# EAGLE design draft6 (EAGLE 6.3)
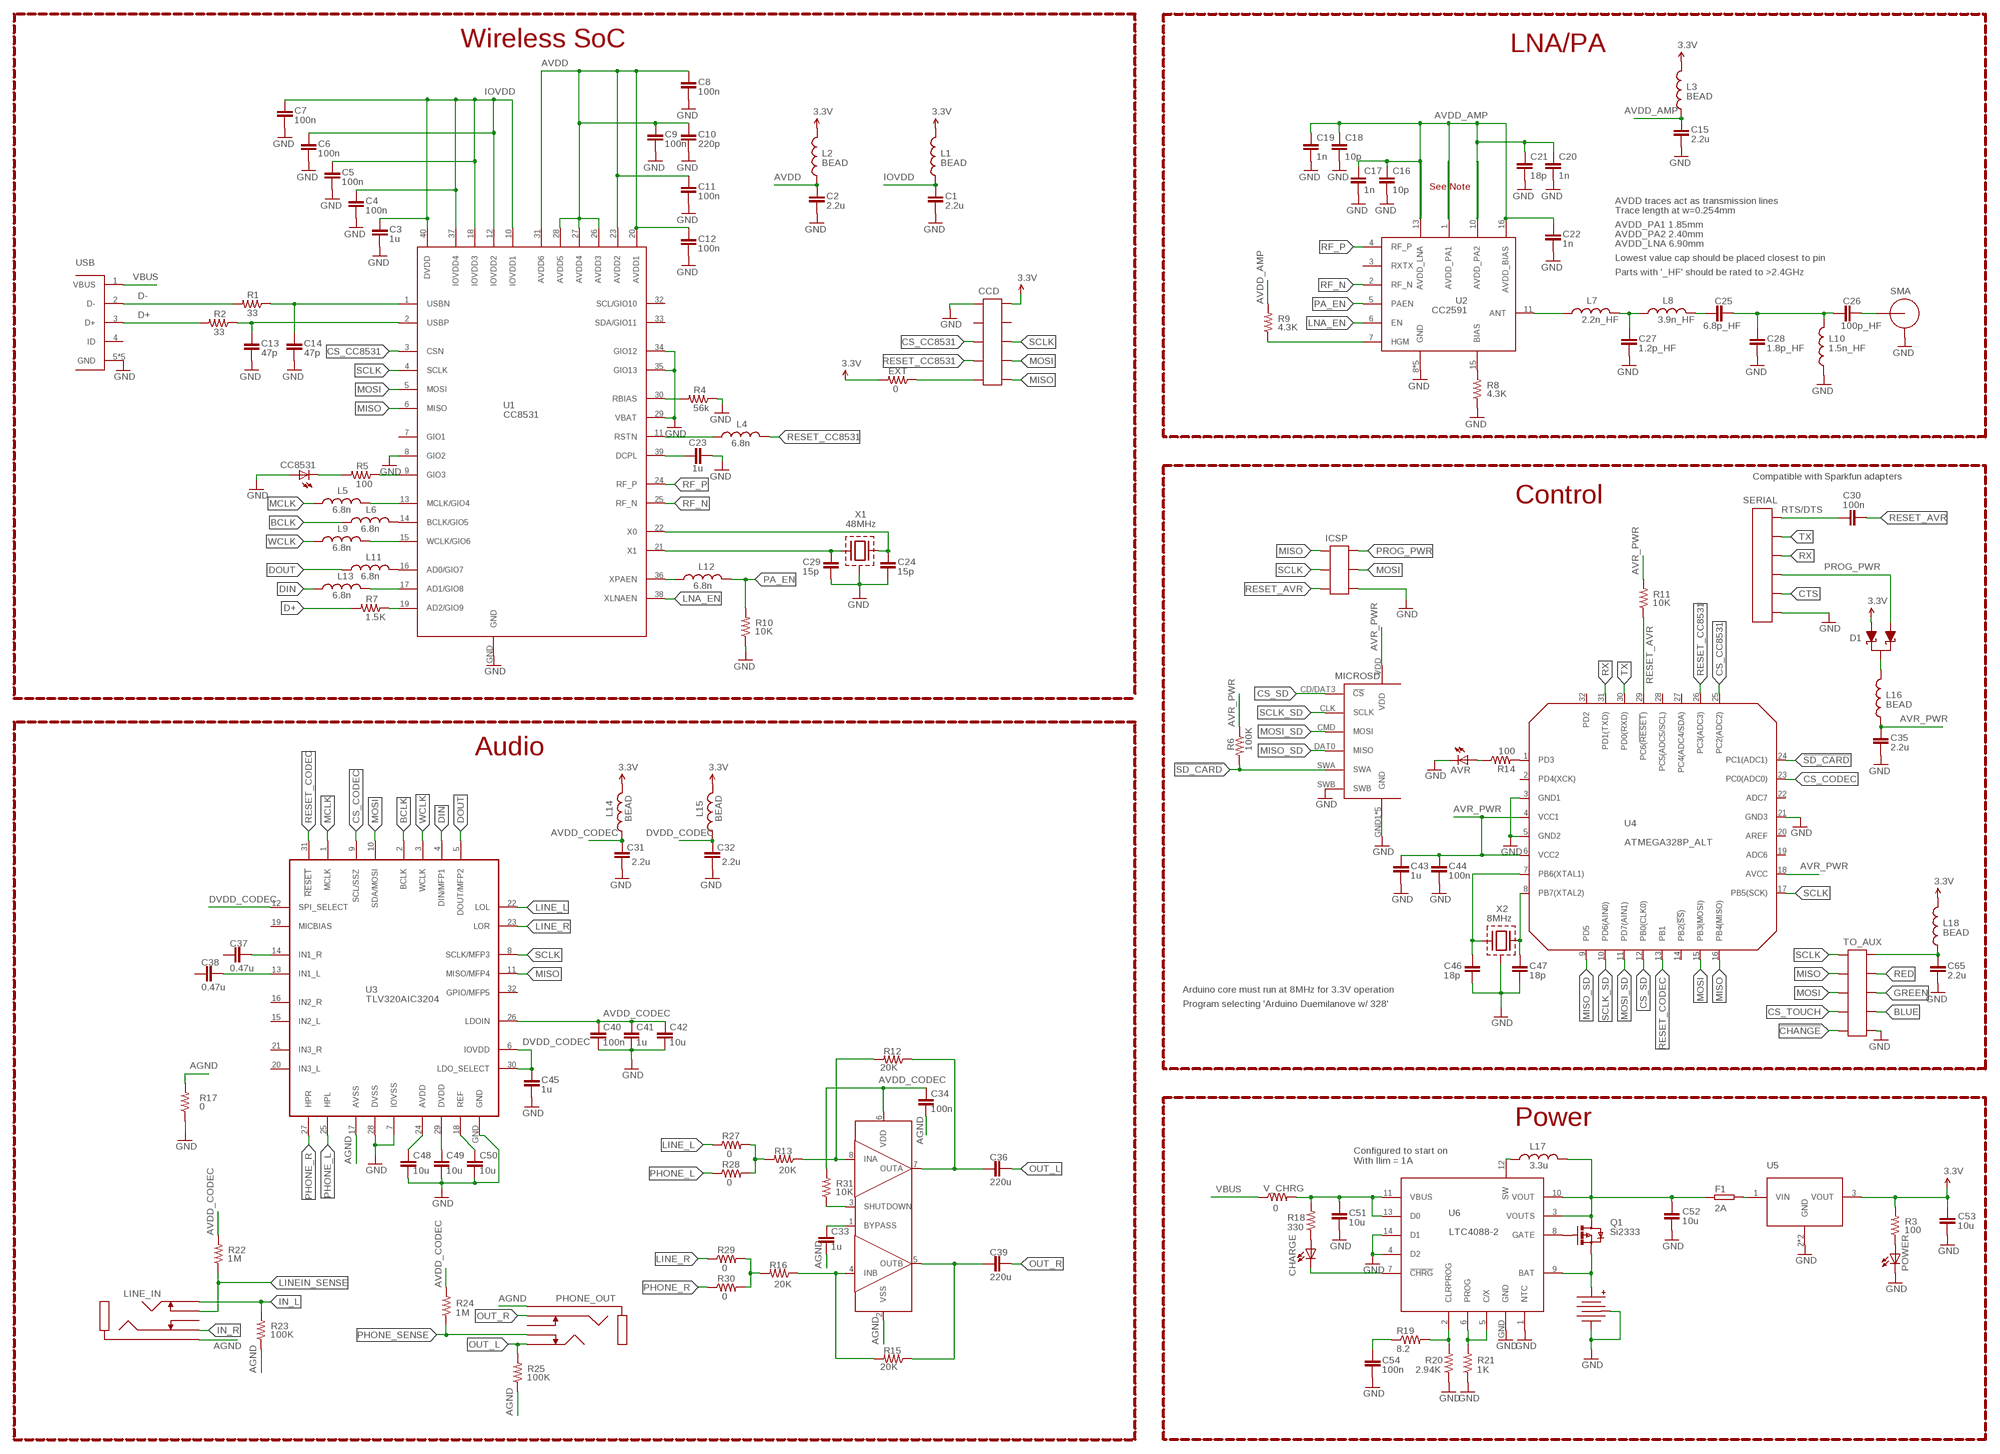
[diagram p0: schematic, sheet 1, part 1 of 2]
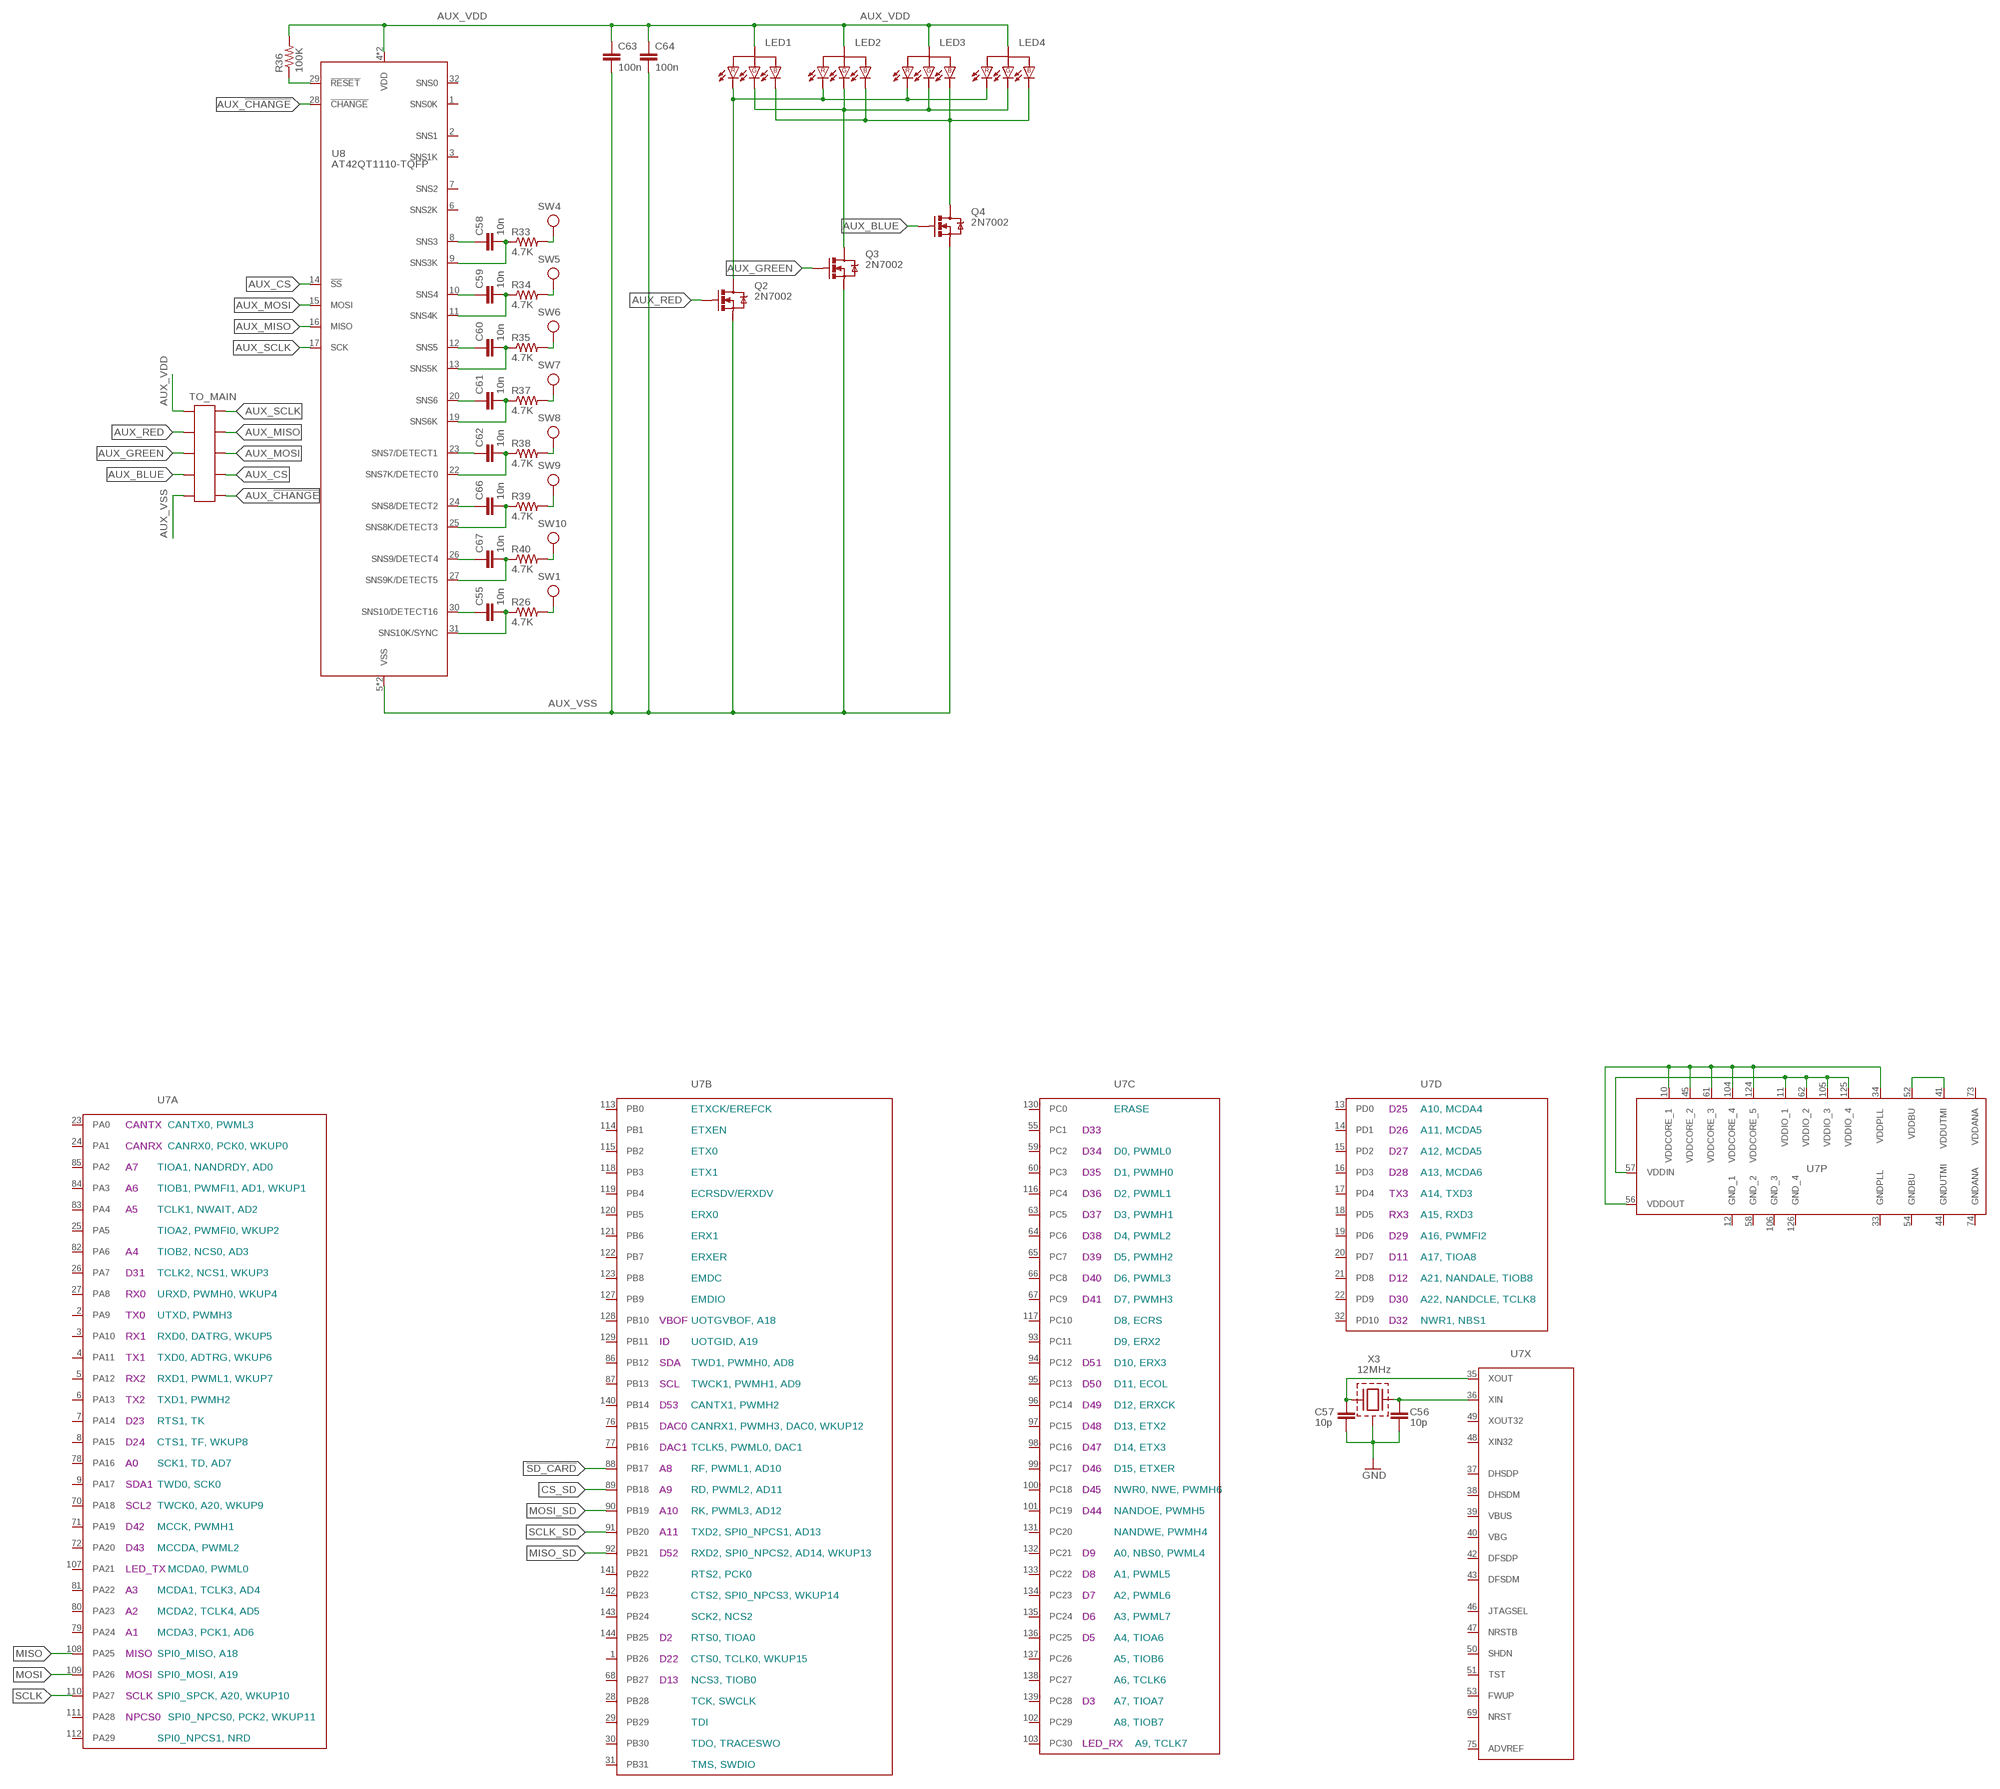
[diagram p1: schematic, sheet 1, part 2 of 2]

## Parts
AVR  LED1206  [LED-1206]
B1  BATTERY-LIPO-JST  [1775469-2]
C1  2.2u  C-EUC0603  [C0603]
C2  2.2u  C-EUC0603  [C0603]
C3  1u  C-EUC0603  [C0603]
C4  100n  C-EUC0603  [C0603]
C5  100n  C-EUC0603  [C0603]
C6  100n  C-EUC0603  [C0603]
C7  100n  C-EUC0603  [C0603]
C8  100n  C-EUC0603  [C0603]
C9  100n  C-EUC0603  [C0603]
C10  220p  C-EUC0603  [C0603]
C11  100n  C-EUC0603  [C0603]
C12  100n  C-EUC0603  [C0603]
C13  47p  C-EUC0603  [C0603]
C14  47p  C-EUC0603  [C0603]
C15  2.2u  C-EUC0603  [C0603]
C16  10p  C-EUC0603  [C0603]
C17  1n  C-EUC0603  [C0603]
C18  10p  C-EUC0603  [C0603]
C19  1n  C-EUC0603  [C0603]
C20  1n  C-EUC0603  [C0603]
C21  18p  C-EUC0603  [C0603]
C22  1n  C-EUC0603  [C0603]
C23  1u  C-EUC0603  [C0603]
C24  15p  C-EUC0603  [C0603]
C25  6.8p_HF  C-EUC0603  [C0603]
C26  100p_HF  C-EUC0603  [C0603]
C27  1.2p_HF  C-EUC0603  [C0603]
C28  1.8p_HF  C-EUC0603  [C0603]
C29  15p  C-EUC0603  [C0603]
C30  100n  C-EUC0603  [C0603]
C31  2.2u  C-EUC0603  [C0603]
C32  2.2u  C-EUC0603  [C0603]
C33  1u  C-EUC0603  [C0603]
C34  100n  C-EUC0603  [C0603]
C35  2.2u  C-EUC0603  [C0603]
C36  220u  C-EUC1210  [C1210]
C37  0.47u  C-EUC0603  [C0603]
C38  0.47u  C-EUC0603  [C0603]
C39  220u  C-EUC1210  [C1210]
C40  100n  C-EUC0603  [C0603]
C41  1u  C-EUC0603  [C0603]
C42  10u  C-EUC0603  [C0603]
C43  1u  C-EUC0603  [C0603]
C44  100n  C-EUC0603  [C0603]
C45  1u  C-EUC0603  [C0603]
C46  18p  C-EUC0603  [C0603]
C47  18p  C-EUC0603  [C0603]
C48  10u  C-EUC0603  [C0603]
C49  10u  C-EUC0603  [C0603]
C50  10u  C-EUC0603  [C0603]
C51  10u  C-EUC0603  [C0603]
C52  10u  C-EUC0603  [C0603]
C53  10u  C-EUC0603  [C0603]
C54  100n  C-EUC0603  [C0603]
C55  10n  C-EUC0603  [C0603]
C56  10p  C-EUC0603  [C0603]
C57  10p  C-EUC0603  [C0603]
C58  10n  C-EUC0603  [C0603]
C59  10n  C-EUC0603  [C0603]
C60  10n  C-EUC0603  [C0603]
C61  10n  C-EUC0603  [C0603]
C62  10n  C-EUC0603  [C0603]
C63  100n  C-EUC0603  [C0603]
C64  100n  C-EUC0603  [C0603]
C65  2.2u  C-EUC0603  [C0603]
C66  10n  C-EUC0603  [C0603]
C67  10n  C-EUC0603  [C0603]
CC8531  LED1206  [LED-1206]
CCD  HEADER-10P-SMD-MALE2  [HEADER-10P-1.27MM]
CHARGE  LED1206  [LED-1206]
D1  DUAL_SCHOTTKY  [SOT-23]
EXT  0  R-US_R0603  [R0603]
F1  2A  PTC_FUSE  [1210]
ICSP  HEADER-6P-SMD-1.27MM  [HEADER-6P-1.27MM]
L1  BEAD  INDUCTOR0603  [0603]
L2  BEAD  INDUCTOR0603  [0603]
L3  BEAD  INDUCTOR0603  [0603]
L4  6.8n  INDUCTOR0603  [0603]
L5  6.8n  INDUCTOR0603  [0603]
L6  6.8n  INDUCTOR0603  [0603]
L7  2.2n_HF  INDUCTOR0603  [0603]
L8  3.9n_HF  INDUCTOR0603  [0603]
L9  6.8n  INDUCTOR0603  [0603]
L10  1.5n_HF  INDUCTOR0603  [0603]
L11  6.8n  INDUCTOR0603  [0603]
L12  6.8n  INDUCTOR0603  [0603]
L13  6.8n  INDUCTOR0603  [0603]
L14  BEAD  INDUCTOR0603  [0603]
L15  BEAD  INDUCTOR0603  [0603]
L16  BEAD  INDUCTOR0603  [0603]
L17  3.3u  IFSC-1111AB-01  [IFSC-1111AB-01]
L18  BEAD  INDUCTOR0603  [0603]
LED1  LED_RGB  [PLCC-4]
LED2  LED_RGB  [PLCC-4]
LED3  LED_RGB  [PLCC-4]
LED4  LED_RGB  [PLCC-4]
LINE_IN  PHONE_SW-STX-35332-5N  [STX-35332-5N]
MICROSD  MICROSD104031-0811  [MOLEX_104031-0811]
PHONE_OUT  PHONE_SW-STX-35332-5N  [STX-35332-5N]
POWER  LED1206  [LED-1206]
Q1  Si2333  MOSFET-PCHANNELSMD  [SOT23-3]
Q2  2N7002  MOSFET-NCHANNELSMD  [SOT23-3]
Q3  2N7002  MOSFET-NCHANNELSMD  [SOT23-3]
Q4  2N7002  MOSFET-NCHANNELSMD  [SOT23-3]
R1  33  R-US_R0603  [R0603]
R2  33  R-US_R0603  [R0603]
R3  100  R-US_R0603  [R0603]
R4  56k  R-US_R0603  [R0603]
R5  100  R-US_R0603  [R0603]
R6  100K  R-US_R0603  [R0603]
R7  1.5K  R-US_R0603  [R0603]
R8  4.3K  R-US_R0603  [R0603]
R9  4.3K  R-US_R0603  [R0603]
R10  10K  R-US_R0603  [R0603]
R11  10K  R-US_R0603  [R0603]
R12  20K  R-US_R0603  [R0603]
R13  20K  R-US_R0603  [R0603]
R14  100  R-US_R0603  [R0603]
R15  20K  R-US_R0603  [R0603]
R16  20K  R-US_R0603  [R0603]
R17  0  R-US_R0603  [R0603]
R18  330  R-US_R0603  [R0603]
R19  8.2  R-US_R0603  [R0603]
R20  2.94K  R-US_R0603  [R0603]
R21  1K  R-US_R0603  [R0603]
R22  1M  R-US_R0603  [R0603]
R23  100K  R-US_R0603  [R0603]
R24  1M  R-US_R0603  [R0603]
R25  100K  R-US_R0603  [R0603]
R26  4.7K  R-US_R0603  [R0603]
R27  0  R-US_R0603  [R0603]
R28  0  R-US_R0603  [R0603]
R29  0  R-US_R0603  [R0603]
R30  0  R-US_R0603  [R0603]
R31  10K  R-US_R0603  [R0603]
R33  4.7K  R-US_R0603  [R0603]
R34  4.7K  R-US_R0603  [R0603]
R35  4.7K  R-US_R0603  [R0603]
R36  100K  R-US_R0603  [R0603]
R37  4.7K  R-US_R0603  [R0603]
R38  4.7K  R-US_R0603  [R0603]
R39  4.7K  R-US_R0603  [R0603]
R40  4.7K  R-US_R0603  [R0603]
SERIAL  HEADER-6X1-961106-5500  [HEADER-3M-961-6P-2.54MM]
SMA  SMA-REVSMA-0.62  [CONREVSMA003.062]
SW1  TOUCH_PAD-CIRCLE-15MM  [TOUCH-CIRCLE-15MM]
SW4  TOUCH_PAD-CIRCLE-15MM  [TOUCH-CIRCLE-15MM]
SW5  TOUCH_PAD-CIRCLE-15MM  [TOUCH-CIRCLE-15MM]
SW6  TOUCH_PAD-CIRCLE-15MM  [TOUCH-CIRCLE-15MM]
SW7  TOUCH_PAD-CIRCLE-15MM  [TOUCH-CIRCLE-15MM]
SW8  TOUCH_PAD-CIRCLE-15MM  [TOUCH-CIRCLE-15MM]
SW9  TOUCH_PAD-CIRCLE-15MM  [TOUCH-CIRCLE-15MM]
SW10  TOUCH_PAD-CIRCLE-15MM  [TOUCH-CIRCLE-15MM]
TO_AUX  HEADER-10P-SMD-2MM-FEMALE  [M22-63405]
TO_MAIN  HEADER-10P-SMD-2MM-MALE  [M22-53205]
U1  CC8531  [S-PVQFN-N40]
U2  CC2591  [S-PVQFN-N16]
U3  TLV320AIC3204  [S-PVQFN-N32]
U4  ATMEGA328P_ALT  [S-PQFP-N32]
U5  MCP1826-SOT223  [SOT-223]
U6  LTC4088-2  LTC4088-1/2  [DFN-14]
U7  ATSAM3X8E_ALT-LQFP-144  [LQFP-144]
U8  AT42QT1110-TQFP  [S-PQFP-N32]
U$15  LM4881  [SO08]
USB  USB_MICRO_AB  [USB_MICRO_AB]
V_CHRG  0  R-US_R0603  [R0603]
X1  48MHz  XTAL-ABRACONABM3C  [ABM3C]
X2  8MHz  XTAL-ABRACONABM3B  [ABM3B]
X3  12MHz  XTAL-ABRACONABM8G  [ABM8G]

## Nets
3.3V [Power]: C53.1 CCD.2 D1.1(A1) EXT.2 L1.2 L2.2 L3.2 L14.2 L15.2 L18.2 R3.2 U5.3(VOUT)
!CHANGE: TO_AUX.9
!SD_CARD: MICROSD.SWA R6.2 U4.24(PC1(ADC1)) U7.88(B:PB17)
AGND [Analog]: C33.2 C34.2 LINE_IN.5(GND) PHONE_OUT.5(GND) R17.2 R23.1 R25.1 U3.17(AVSS) U$15.2(VSS)
AUX_!CHANGE: TO_MAIN.10 U8.28(!CHANGE)
AUX_BLUE: Q4.1(G) TO_MAIN.7
AUX_CS: TO_MAIN.8 U8.14(!SS)
AUX_GREEN: Q3.1(G) TO_MAIN.5
AUX_MISO: TO_MAIN.4 U8.16(MISO)
AUX_MOSI: TO_MAIN.6 U8.15(MOSI)
AUX_RED: Q2.1(G) TO_MAIN.3
AUX_SCLK: TO_MAIN.2 U8.17(SCK)
AUX_VDD: C63.1 C64.1 LED1.2(A) LED1.2-2(A) LED2.2(A) LED2.2-2(A) LED3.2(A) LED3.2-2(A) LED4.2(A) LED4.2-2(A) R36.2 TO_MAIN.1 U8.4(VDD) U8.18(VDD)
AUX_VSS: C63.2 C64.2 Q2.2(S) Q3.2(S) Q4.2(S) TO_MAIN.9 U8.5(VSS) U8.21(VSS)
AVDD: C2.1 C8.1 C9.1 C10.1 C11.1 C12.1 L2.1 U1.20(AVDD1) U1.23(AVDD2) U1.26(AVDD3) U1.27(AVDD4) U1.28(AVDD5) U1.31(AVDD6)
AVDD_AMP: C15.1 C16.1 C17.1 C18.1 C19.1 C20.1 C21.1 C22.1 L3.1 R9.2 U2.1(AVDD_PA1) U2.10(AVDD_PA2) U2.13(AVDD_LNA) U2.16(AVDD_BIAS)
AVDD_CODEC: C31.1 C34.1 C40.1 C41.1 C42.1 L14.1 R22.2 R24.2 R31.2 U3.26(LDOIN) U$15.6(VDD)
AVR_PWR: C35.1 C43.1 C44.1 L16.1 MICROSD.VDD R6.1 R11.2 U4.4(VCC1) U4.6(VCC2) U4.18(AVCC)
BAT [Power]: B1.+(P) Q1.2(S) U6.9(BAT)
BCLK: L6.1 U3.2(BCLK)
BLUE: TO_AUX.8
CS_CC8531: CCD.5 U1.3(CSN) U4.25(PC2(ADC2))
CS_CODEC: U3.9(SCL/SSZ) U4.23(PC0(ADC0))
CS_SD: MICROSD.CD/DAT3(!CS) U4.12(PB0(CLK0)) U7.89(B:PB18)
CS_TOUCH: TO_AUX.7
CTS: SERIAL.2
D+: R2.2 R7.2 USB.3(D+)
D-: R1.2 USB.2(D-)
DIN: L13.1 U3.4(DIN/MFP1)
DOUT: L11.1 U3.5(DOUT/MFP2)
DVDD: C49.1 U3.29(DVDD)
DVDD_CODEC: C32.1 C45.1 L15.1 U3.6(IOVDD) U3.12(SPI_SELECT) U3.30(LDO_SELECT)
GND [Power]: AVR.C B1.-(N) B1.X1(CASE) B1.X2(CASE) C1.2 C2.2 C3.2 C4.2 C5.2 C6.2 C7.2 C8.2 C9.2 C10.2 C11.2 C12.2 C13.2 C14.2 C15.2 C16.2 C17.2 C18.2 C19.2 C20.2 C21.2 C22.2 C23.2 C24.2 C27.2 C28.2 C29.2 C31.2 C32.2 C35.2 C40.2 C41.2 C42.2 C43.2 C44.2 C45.2 C46.2 C47.2 C48.2 C49.2 C50.2 C51.2 C52.2 C53.2 C54.2 C56.2 C57.2 C65.2 CC8531.A CCD.1 ICSP.6 L10.1 MICROSD.GND1(GND) MICROSD.GND2(GND) MICROSD.GND3(GND) MICROSD.GND4(GND) MICROSD.SWB MICROSD.VSS(GND) POWER.C R4.1 R8.1 R10.1 R17.1 R20.1 R21.1 SERIAL.1 SMA.GND1(GND) SMA.GND2(GND) SMA.GND3(GND) SMA.GND4(GND) TO_AUX.10 U1.8(GIO2) U1.29(VBAT) U1.34(GIO12) U1.35(GIO13) U1.GND U2.8(GND) U2.9(GND) U2.12(GND) U2.14(GND) U2.GND U3.7(IOVSS) U3.28(DVSS) U3.GND U4.3(GND1) U4.5(GND2) U4.21(GND3) U5.2(GND) U5.4(GND) U6.1(NTC) U6.4(D2) U6.14(D1) U6.GND USB.5(GND) USB.GND1(GND) USB.GND2(GND) USB.GND3(GND) USB.GND4(GND) X1.2(CASE) X1.4(CASE) X2.2(CASE) X2.4(CASE) X3.GND-1(CASE) X3.GND-2(CASE)
GREEN: TO_AUX.6
IN_L: LINE_IN.4(L) R23.2
IN_R: LINE_IN.1(R)
IOVDD: C1.1 C3.1 C4.1 C5.1 C6.1 C7.1 L1.1 U1.10(IOVDD1) U1.12(IOVDD2) U1.18(IOVDD3) U1.37(IOVDD4) U1.40(DVDD)
IOVDD1: C14.1 R1.1 U1.1(USBN)
IOVDD2: C13.1 R2.1 U1.2(USBP)
LINE_L: R27.1 U3.22(LOL)
LINE_R: R29.1 U3.23(LOR)
LINEIN_SENSE: LINE_IN.3(L_SW) R22.1
LNA_EN: U1.38(XLNAEN) U2.6(EN)
MCLK: L5.1 U3.1(MCLK)
MISO: CCD.10 ICSP.1 TO_AUX.3 U1.6(MISO) U3.11(MISO/MFP4) U4.16(PB4(MISO)) U7.108(A:PA25)
MISO_SD: MICROSD.DAT0(MISO) U4.9(PD5) U7.92(B:PB21)
MOSI: CCD.8 ICSP.4 TO_AUX.5 U1.5(MOSI) U3.10(SDA/MOSI) U4.15(PB3(MOSI)) U7.109(A:PA26)
MOSI_SD: MICROSD.CMD(MOSI) U4.11(PD7(AIN1)) U7.90(B:PB19)
N$1: C29.1 U1.21(X1) X1.1
N$2: C24.1 U1.22(X0) X1.3
N$3: L4.1 U1.11(RSTN)
N$4: L11.2 U1.16(AD0/GIO7)
N$5: L6.2 U1.14(BCLK/GIO5)
N$6: D1.3(C1) L16.2
N$7: R8.2 U2.15(BIAS)
N$8: R9.1 U2.7(HGM)
N$9: C26.2 SMA.SIG
N$10: C55.2 R26.1 U8.31(SNS10K/SYNC)
N$11: C55.1 U8.30(SNS10/DETECT16)
N$12: C46.1 U4.7(PB6(XTAL1)) X2.1
N$13: L7.1 U2.11(ANT)
N$14: C27.1 L7.2 L8.1
N$15: C25.1 L8.2
N$16: C25.2 C26.1 C28.1 L10.2
N$17: C48.1 U3.24(AVDD)
N$18: L12.1 U1.36(XPAEN)
N$19: R4.2 U1.30(RBIAS)
N$20: C47.1 U4.8(PB7(XTAL2)) X2.3
N$21: C23.1 U1.39(DCPL)
N$22: F1.2 U5.1(VIN)
N$23: L5.2 U1.13(MCLK/GIO4)
N$24: R7.1 U1.19(AD2/GIO9)
N$25: L9.2 U1.15(WCLK/GIO6)
N$26: C33.1 U$15.1(BYPASS)
N$27: L13.2 U1.17(AD1/GIO8)
N$28: R5.1 U1.9(GIO3)
N$29: CC8531.C R5.2
N$30: C58.2 R33.1 U8.9(SNS3K)
N$31: POWER.A R3.1
N$32: CHARGE.C U6.7(!CHRG)
N$33: CHARGE.A R18.1
N$34 [Analog]: C37.2 U3.14(IN1_R)
N$35 [Analog]: C38.2 U3.13(IN1_L)
N$36: L17.1 U6.12(SW)
N$37: R21.2 U6.5(C/X) U6.6(PROG)
N$38: R19.2 R20.2 U6.2(CLRPROG)
N$39: C36.1 R12.1 U$15.7(OUTA)
N$40: C39.1 R15.1 U$15.5(OUTB)
N$41: C59.2 R34.1 U8.11(SNS4K)
N$42: C60.2 R35.1 U8.13(SNS5K)
N$43: R13.2 R27.2 R28.2
N$44: R26.2 SW1.P$1
N$45: R16.2 R29.2 R30.2
N$46: R14.2 U4.1(PD3)
N$47: AVR.A R14.1
N$48: C54.1 R19.1
N$49 [Power]: C52.1 F1.1 L17.2 Q1.3(D) U6.3(VOUTS) U6.10(VOUT)
N$50: CCD.9 EXT.1
N$51: Q1.1(G) U6.8(GATE)
N$52 [Power]: C51.1 R18.2 U6.11(VBUS) U6.13(D0) V_CHRG.2
N$53: R12.2 R13.1 U$15.8(INA)
N$54: R15.2 R16.1 U$15.4(INB)
N$55: R31.1 U$15.3(SHUTDOWN)
N$56: U7.11(P:VDDIO_1) U7.57(P:VDDIN) U7.62(P:VDDIO_2) U7.105(P:VDDIO_3) U7.125(P:VDDIO_4)
N$57: U7.10(P:VDDCORE_1) U7.34(P:VDDPLL) U7.45(P:VDDCORE_2) U7.56(P:VDDOUT) U7.61(P:VDDCORE_3) U7.104(P:VDDCORE_4) U7.124(P:VDDCORE_5)
N$58: U7.41(P:VDDUTMI) U7.52(P:VDDBU)
N$59: C56.1 U7.36(X:XIN) X3.X2
N$60: C58.1 U8.8(SNS3)
N$61: R33.2 SW4.P$1
N$62: C59.1 U8.10(SNS4)
N$63: R34.2 SW5.P$1
N$64: C60.1 U8.12(SNS5)
N$65: R35.2 SW6.P$1
N$66: C66.2 R39.1 U8.25(SNS8K/DETECT3)
N$67: C65.1 L18.1 TO_AUX.2
N$68: C67.2 R40.1 U8.27(SNS9K/DETECT5)
N$69: C66.1 U8.24(SNS8/DETECT2)
N$70: R39.2 SW9.P$1
N$71: C61.2 R37.1 U8.19(SNS6K)
N$72: R37.2 SW7.P$1
N$73: C62.2 R38.1 U8.22(SNS7K/DETECT0)
N$74: R38.2 SW8.P$1
N$75: C62.1 U8.23(SNS7/DETECT1)
N$76: C61.1 U8.20(SNS6)
N$77: R36.1 U8.29(!RESET)
N$78: LED1.1(KR) LED1.1-2(KR) LED2.1(KR) LED2.1-2(KR) LED3.1(KR) LED3.1-2(KR) LED4.1(KR) LED4.1-2(KR) Q2.3(D)
N$79: LED1.4(KG) LED1.4-2(KG) LED2.4(KG) LED2.4-2(KG) LED3.4(KG) LED3.4-2(KG) LED4.4(KG) LED4.4-2(KG) Q3.3(D)
N$80: LED1.3(KB) LED1.3-2(KB) LED2.3(KB) LED2.3-2(KB) LED3.3(KB) LED3.3-2(KB) LED4.3(KB) LED4.3-2(KB) Q4.3(D)
N$81: C67.1 U8.26(SNS9/DETECT4)
N$82: R40.2 SW10.P$1
N$83: C57.1 U7.35(X:XOUT) X3.X1
OUT_L: C36.2 PHONE_OUT.4(L) R25.2
OUT_R [Analog]: C39.2 PHONE_OUT.1(R)
PA_EN: L12.2 R10.2 U2.5(PAEN)
PHONE_L: R28.1 U3.25(HPL)
PHONE_R: R30.1 U3.27(HPR)
PHONE_SENSE: PHONE_OUT.3(L_SW) R24.1
PROG_PWR: D1.2(A) ICSP.2 SERIAL.3
RED: TO_AUX.4
REF: C50.1 U3.18(REF)
RESET_AVR: C30.2 ICSP.5 R11.1 U4.29(PC6(!RESET!))
RESET_CC8531: CCD.7 L4.2 U4.26(PC3(ADC3))
RESET_CODEC: U3.31(!RESET) U4.13(PB1)
RF_N: U1.25(RF_N) U2.2(RF_N)
RF_P: U1.24(RF_P) U2.4(RF_P)
RTS/DTS: C30.1 SERIAL.6
RX: SERIAL.4 U4.31(PD1(TXD))
SCLK: CCD.6 ICSP.3 TO_AUX.1 U1.4(SCLK) U3.8(SCLK/MFP3) U4.17(PB5(SCK)) U7.110(A:PA27)
SCLK_SD: MICROSD.CLK(SCLK) U4.10(PD6(AIN0)) U7.91(B:PB20)
TX: SERIAL.5 U4.30(PD0(RXD))
VBUS [Power]: USB.1(VBUS) V_CHRG.1
WCLK: L9.1 U3.3(WCLK)
Unconnected: C37.1 C38.1 CCD.3 CCD.4 LINE_IN.2(R_SW) PHONE_OUT.2(R_SW) U1.7(GIO1) U1.32(SCL/GIO10) U1.33(SDA/GIO11) U2.3(RXTX) U3.15(IN2_L) U3.16(IN2_R) U3.19(MICBIAS) U3.20(IN3_L) U3.21(IN3_R) U3.32(GPIO/MFP5) U4.2(PD4(XCK)) U4.14(PB2(!SS!)) U4.19(ADC6) U4.20(AREF) U4.22(ADC7) U4.27(PC4(ADC4/SDA)) U4.28(PC5(ADC5/SCL)) U4.32(PD2) U7.1(B:PB26) U7.2(A:PA9) U7.3(A:PA10) U7.4(A:PA11) U7.5(A:PA12) U7.6(A:PA13) U7.7(A:PA14) U7.8(A:PA15) U7.9(A:PA17) U7.12(P:GND_1) U7.13(D:PD0) U7.14(D:PD1) U7.15(D:PD2) U7.16(D:PD3) U7.17(D:PD4) U7.18(D:PD5) U7.19(D:PD6) U7.20(D:PD7) U7.21(D:PD8) U7.22(D:PD9) U7.23(A:PA0) U7.24(A:PA1) U7.25(A:PA5) U7.26(A:PA7) U7.27(A:PA8) U7.28(B:PB28) U7.29(B:PB29) U7.30(B:PB30) U7.31(B:PB31) U7.32(D:PD10) U7.33(P:GNDPLL) U7.37(X:DHSDP) U7.38(X:DHSDM) U7.39(X:VBUS) U7.40(X:VBG) U7.42(X:DFSDP) U7.43(X:DFSDM) U7.44(P:GNDUTMI) U7.46(X:JTAGSEL) U7.47(X:NRSTB) U7.48(X:XIN32) U7.49(X:XOUT32) U7.50(X:SHDN) U7.51(X:TST) U7.53(X:FWUP) U7.54(P:GNDBU) U7.55(C:PC1) U7.58(P:GND_2) U7.59(C:PC2) U7.60(C:PC3) U7.63(C:PC5) U7.64(C:PC6) U7.65(C:PC7) U7.66(C:PC8) U7.67(C:PC9) U7.68(B:PB27) U7.69(X:NRST) U7.70(A:PA18) U7.71(A:PA19) U7.72(A:PA20) U7.73(P:VDDANA) U7.74(P:GNDANA) U7.75(X:ADVREF) U7.76(B:PB15) U7.77(B:PB16) U7.78(A:PA16) U7.79(A:PA24) U7.80(A:PA23) U7.81(A:PA22) U7.82(A:PA6) U7.83(A:PA4) U7.84(A:PA3) U7.85(A:PA2) U7.86(B:PB12) U7.87(B:PB13) U7.93(C:PC11) U7.94(C:PC12) U7.95(C:PC13) U7.96(C:PC14) U7.97(C:PC15) U7.98(C:PC16) U7.99(C:PC17) U7.100(C:PC18) U7.101(C:PC19) U7.102(C:PC29) U7.103(C:PC30) U7.106(P:GND_3) U7.107(A:PA21) U7.111(A:PA28) U7.112(A:PA29) U7.113(B:PB0) U7.114(B:PB1) U7.115(B:PB2) U7.116(C:PC4) U7.117(C:PC10) U7.118(B:PB3) U7.119(B:PB4) U7.120(B:PB5) U7.121(B:PB6) U7.122(B:PB7) U7.123(B:PB8) U7.126(P:GND_4) U7.127(B:PB9) U7.128(B:PB10) U7.129(B:PB11) U7.130(C:PC0) U7.131(C:PC20) U7.132(C:PC21) U7.133(C:PC22) U7.134(C:PC23) U7.135(C:PC24) U7.136(C:PC25) U7.137(C:PC26) U7.138(C:PC27) U7.139(C:PC28) U7.140(B:PB14) U7.141(B:PB22) U7.142(B:PB23) U7.143(B:PB24) U7.144(B:PB25) U8.1(SNS0K) U8.2(SNS1) U8.3(SNS1K) U8.6(SNS2K) U8.7(SNS2) U8.32(SNS0) USB.4(ID)

## Notes on the sheet
- Wireless SoC | LNA/PA
- See Note
- AVDD traces act as transmission lines
- Trace length at w=0.254mm
- AVDD_PA1 1.85mm
- AVDD_PA2 2.40mm
- AVDD_LNA 6.90mm
- Lowest value cap should be placed closest to pin
- Parts with '_HF' should be rated to >2.4GHz
- Compatible with Sparkfun adapters
- Control
- Audio
- Arduino core must run at 8MHz for 3.3V operation
- Program selecting 'Arduino Duemilanove w/ 328'
- Power
- Configured to start on
  With Ilim = 1A

## Library data of the parts
AVR CC8531 CHARGE POWER = SparkFun-LED:LED: LEDs Standard schematic elements and footprints for 5mm, 3mm, 1206, and 0603 sized LEDs. 5mm - Spark Fun Electronics SKU : COM-00529 (and others)
B1 = 00-EvaLibrary:BATTERY
C1-C35 C37 C38 C40-C45 C48-C50 C52 C53 C55 C58-C67 = rcl:C-EU: CAPACITOR, European symbol
C36 C39 C46 C47 C51 C54 C56 C57 = 00-EvaLibrary:C-EU: CAPACITOR, European symbol
CCD TO_AUX TO_MAIN = 00-EvaLibrary:HEADER-10P
D1 = 00-EvaLibrary:DUAL_SCHOTTKY
EXT R1-R11 R14 R17 R22-R26 R31 R33-R40 = rcl:R-US_: RESISTOR, American symbol
F1 = 00-EvaLibrary:PTC_FUSE
ICSP = 00-EvaLibrary:HEADER-6P
L1-L16 L18 = SparkFun-Passives:INDUCTOR: Inductors Basic Inductor/Choke - 0603 and 1206. Footprints are not proven and vary greatly between part numbers.
L17 = 00-EvaLibrary:IFSC-1111AB-01
LED1-LED4 = 00-EvaLibrary:LED_RGB
LINE_IN PHONE_OUT = 00-EvaLibrary:PHONE_SW
MICROSD = 00-EvaLibrary:MICROSD
Q1 = SparkFun-DiscreteSemi:MOSFET-PCHANNEL: Generic PMOSFET
Q2-Q4 = SparkFun-DiscreteSemi:MOSFET-NCHANNEL: Generic NMOS footprint
R12 R13 R15 R16 R18-R21 R27-R30 V_CHRG = 00-EvaLibrary:R-US_: RESISTOR, American symbol
SERIAL = 00-EvaLibrary:HEADER-6X1
SMA = 00-EvaLibrary:SMA
SW1 SW4-SW10 = 00-EvaLibrary:TOUCH_PAD
U1 = 00-EvaLibrary:CC8531
U2 = 00-EvaLibrary:CC2591
U3 = 00-EvaLibrary:TLV320AIC3204
U4 = 00-EvaLibrary:ATMEGA328P_ALT
U5 = 00-EvaLibrary:MCP1826
U6 = 00-EvaLibrary:LTC4088-1/2
U7 = 00-EvaLibrary:ATSAM3X8E_ALT
U8 = 00-EvaLibrary:AT42QT1110
U$15 = 00-EvaLibrary:LM4881
USB = 00-EvaLibrary:USB_MICRO_AB
X1-X3 = 00-EvaLibrary:XTAL-ABRACON

## Board
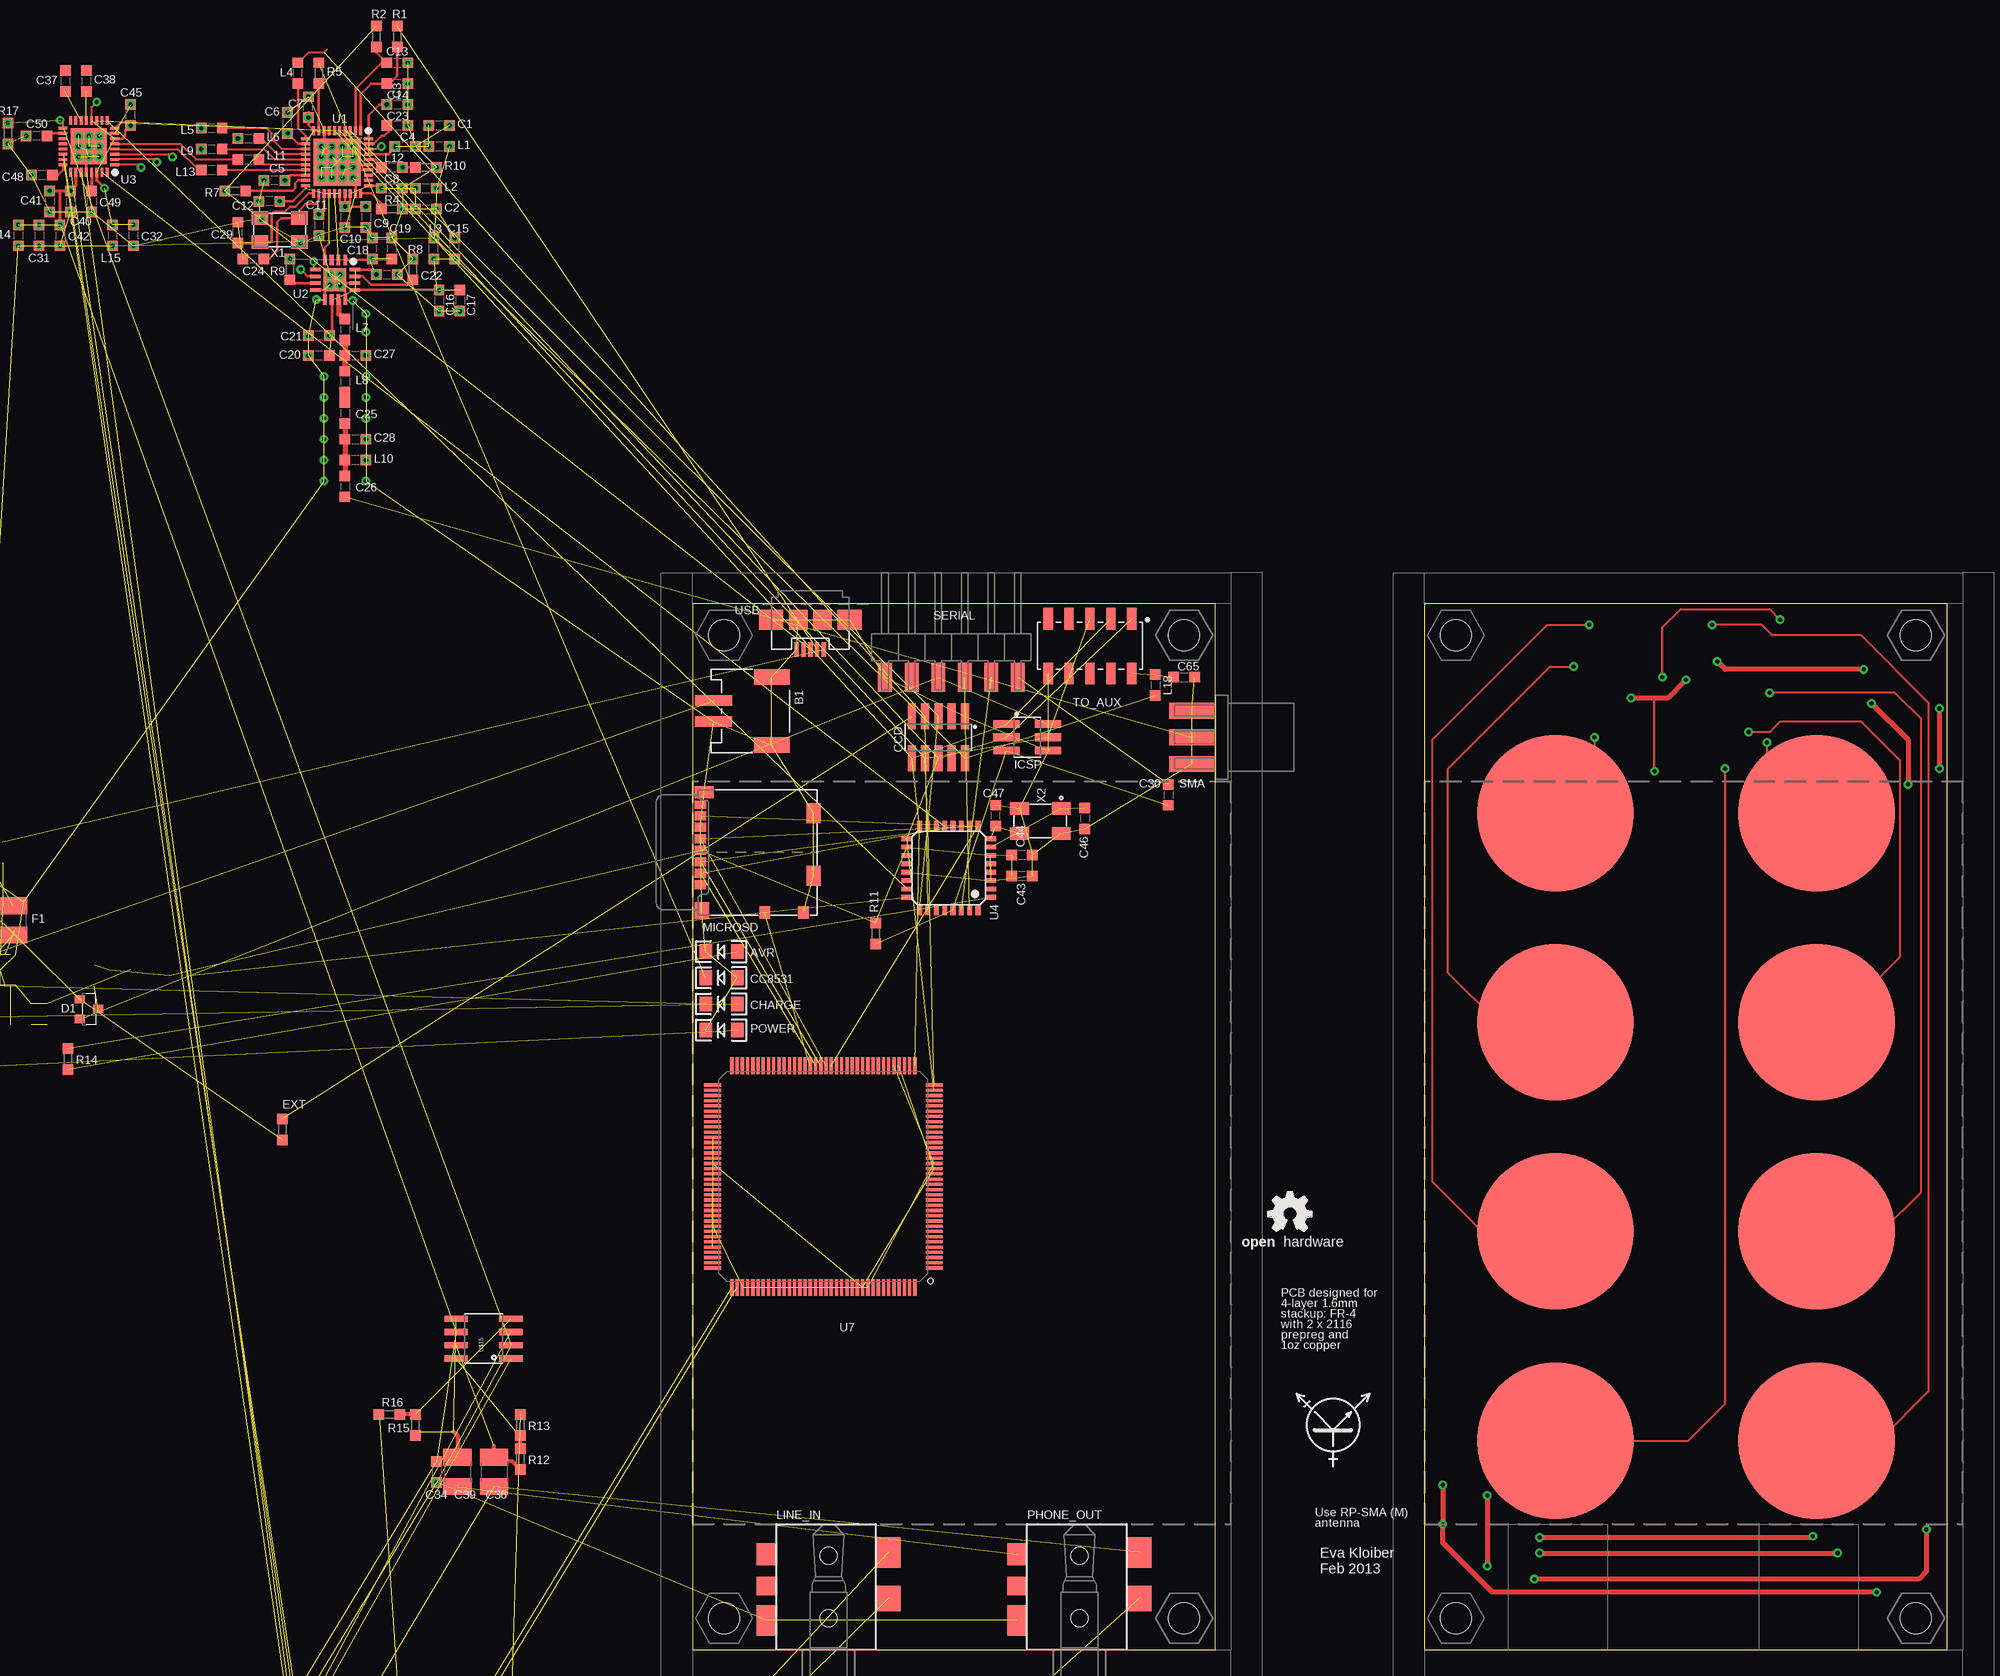
[diagram p2: board, top side]
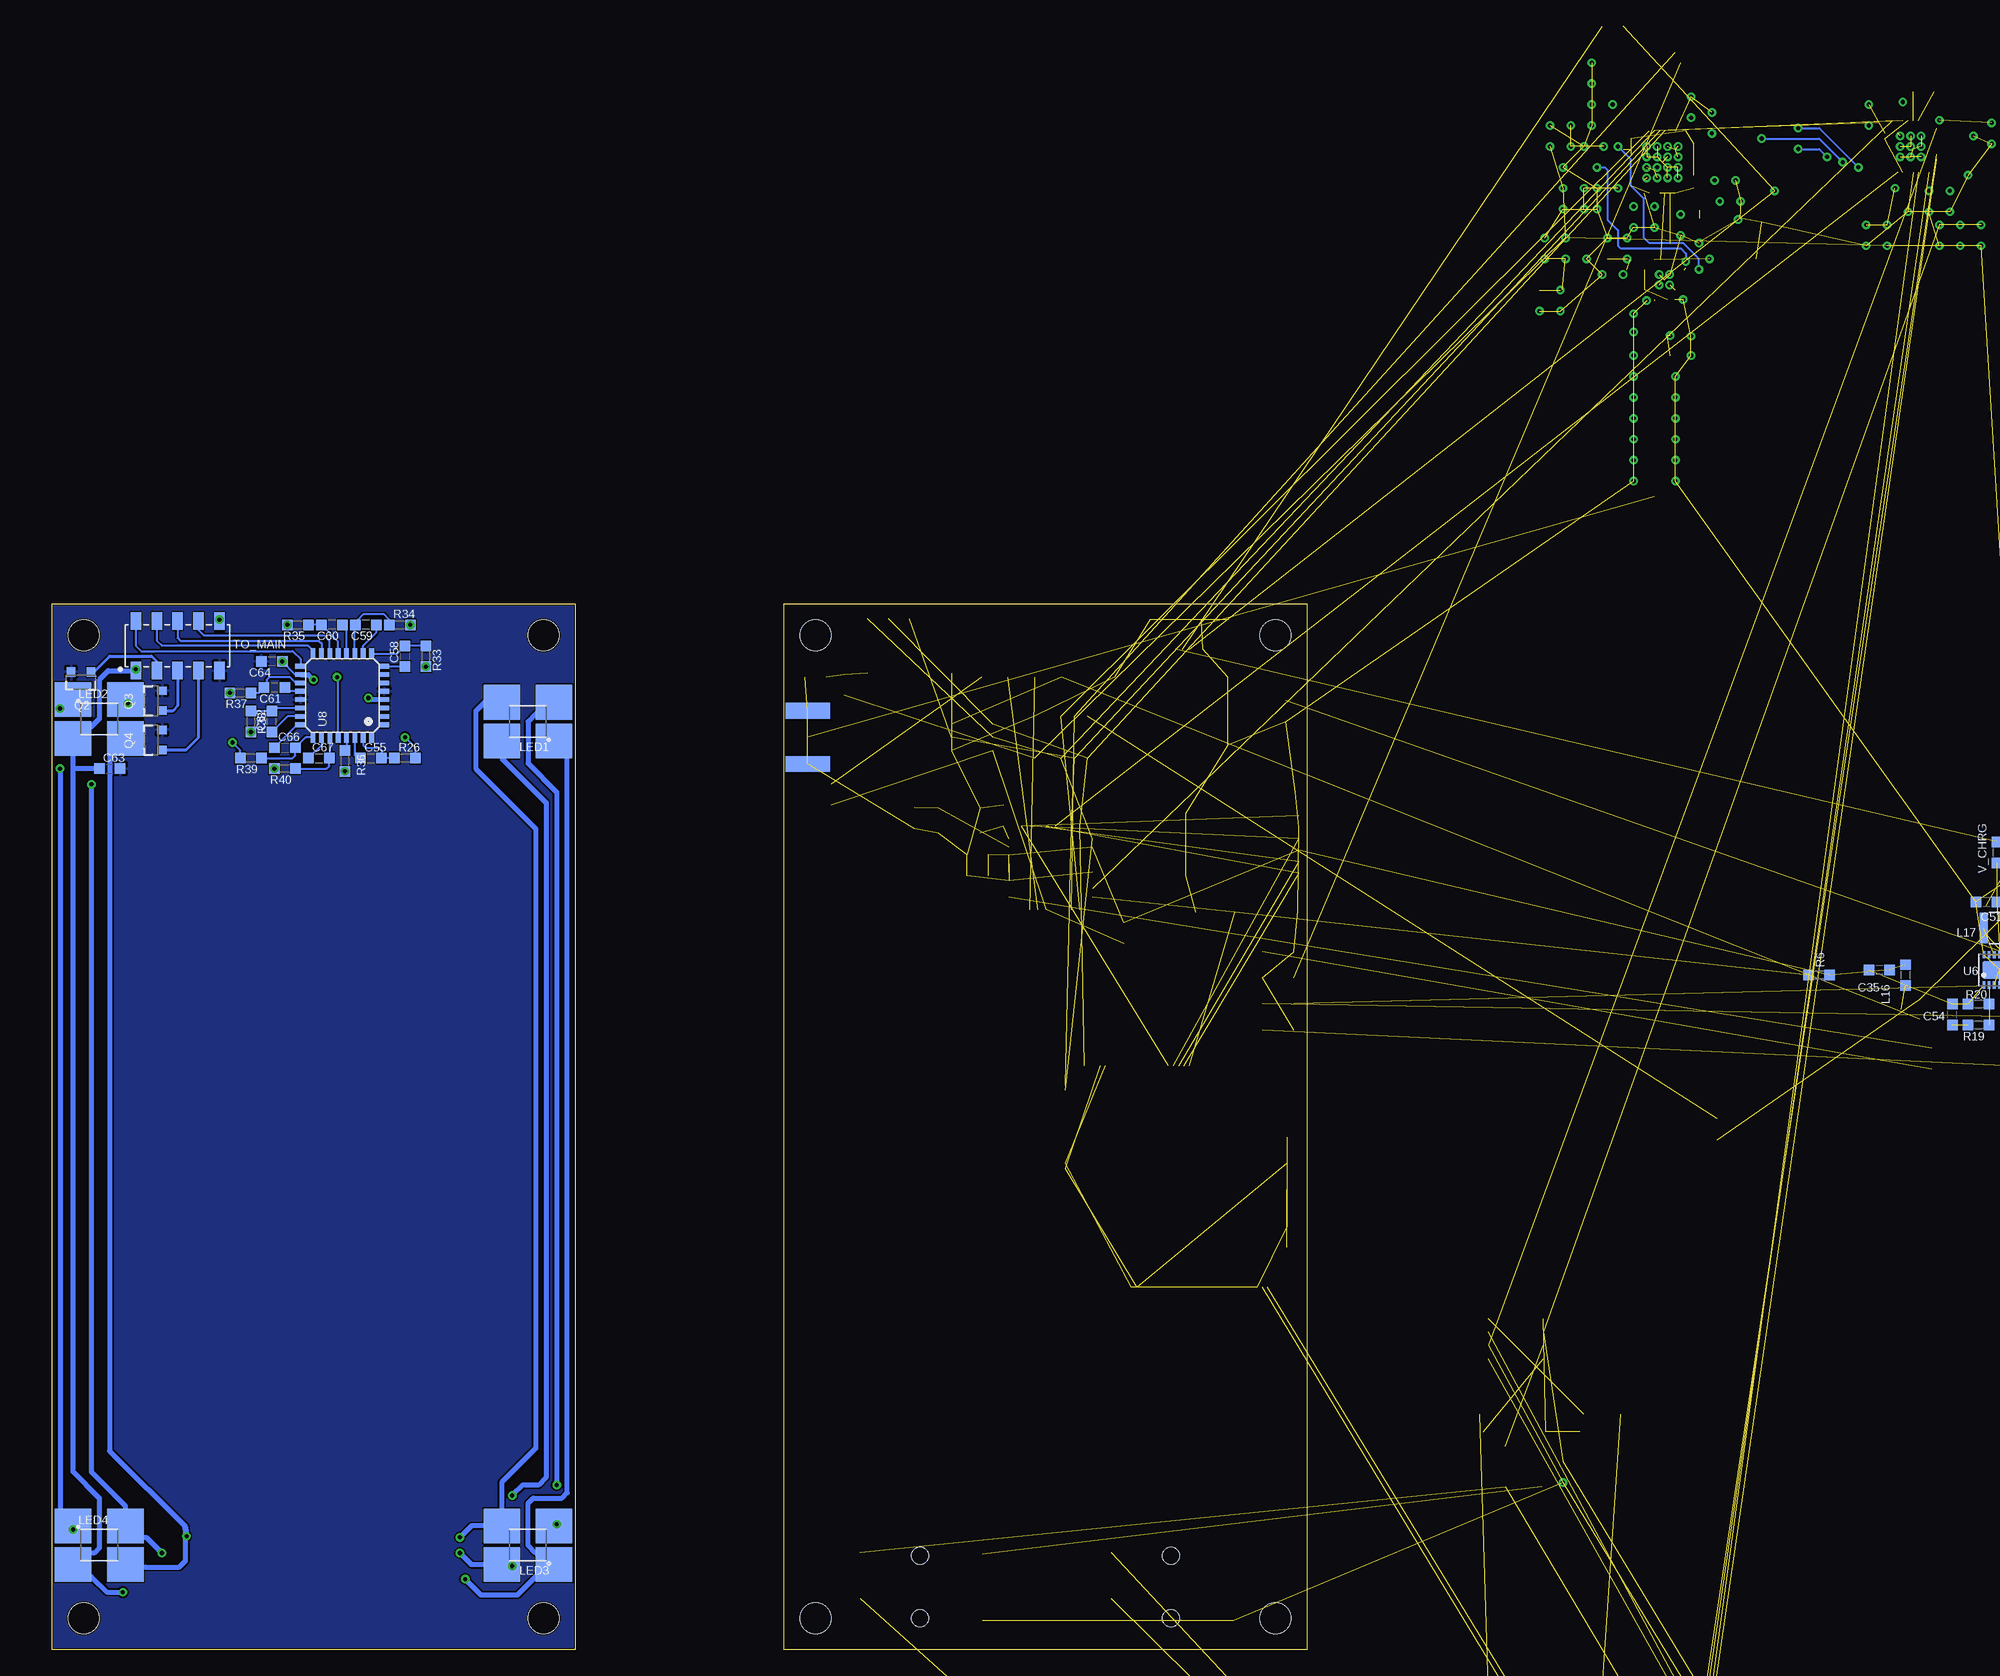
[diagram p3: board, bottom side, seen from below]

Size 120 x 100 mm. Coordinates in mm from the lower left corner, seen from the top.
Outline: 0,0 50,0 50,100 0,100 0,0
Outline: 70,0 120,0 120,100 70,100 70,0
Copper layers (1+2*3+16): Top 0.034290625mm / dielectric 0.24891875mm / Route2 0.034290625mm / dielectric 39mil / Route3 0.034290625mm / dielectric 0.24891875mm / Bottom 0.034290625mm
Design rules "default": minimum track width 6mil, minimum drill 15mil, track to track 6mil, track to pad 6mil, pad to pad 6mil, via to via 6mil, smd to smd 0mil, copper to edge 6mil, drill to drill 6mil, minimum pad ring 10mil, minimum via ring 8mil, stop-mask expansion 4mil, vias tented up to drill 0mil, thermal gap 10mil
tRestrict: area -34.2,105.2 to -32.2,127.8; area -35,126.2 to -34.2,128.2; area -34.2,127.8 to -33,128.5; area -31.8,129.5 to -24.8,130.5; area -33.2,132.5 to -31,133.5; area -35.5,133 to -33.5,139.8

### Footprints (pad centres in the part's own frame; a part is rotated, then mirrored left to right if it is on the bottom)
LED-1206 = smd 1.2 x 1.4: A -1.5,0; C 1.5,0
1775469-2 = smd 1 x 3.5: + -1,-1.75; - 1,-1.75 | smd 1.5 x 3.4: X1 -3.25,3.8; X2 3.25,3.8
C0603 = smd 1 x 1: 1 -1,0; 2 1,0
C1210 = smd 1.6 x 2.7: 1 -1.4,0; 2 1.4,0
HEADER-10P-1.27MM = smd 0.75 x 2.5: 1 -2.54,-2; 2 -2.54,2; 3 -1.27,-2; 4 -1.27,2; 5 0,-2; 6 0,2; 7 1.27,-2; 8 1.27,2; 9 2.54,-2; 10 2.54,2
SOT-23 = smd 0.802 x 0.972: 1 -0.95,-0.885; 2 0.95,-0.885; 3 0,0.885
R0603 = smd 1 x 1: 1 -1,0; 2 1,0
1210 = smd 1.6 x 2.7: 1 -1.4,0; 2 1.4,0
HEADER-6P-1.27MM = smd 0.75 x 2.5: 1 -1.27,-2; 2 -1.27,2; 3 0,-2; 4 0,2; 5 1.27,-2; 6 1.27,2
0603 = smd 1 x 1: 1 -1,0; 2 1,0
IFSC-1111AB-01 = smd 0.8 x 2.9: 1 -1.5,0; 2 1.5,0
PLCC-4 = smd 1.5 x 1.1: 1 -1.5,0.75; 2 -1.5,-0.75; 3 1.5,-0.75; 4 1.5,0.75 | smd 3.5 x 3.3: 1-2 -2.5,1.85; 2-2 -2.5,-1.85; 3-2 2.5,-1.85; 4-2 2.5,1.85
STX-35332-5N = smd 1.75 x 2.1: 1 -6,9.15 | smd 1.75 x 1.8: 2 -6,6.1 | smd 2.25 x 2.4: 3 5.75,4.9 | smd 2.25 x 2.9: 4 5.75,9.3 | smd 1.75 x 2.9: 5 -6,2.8 | hole 1.6: 0,9; 0,3
MOLEX_104031-0811 = smd 0.85 x 1.1: CD/DAT3 2.005,0.25; CLK -1.295,0.25; CMD 0.905,0.25; DAT0 -3.495,0.25; DAT2 3.105,0.25; VDD -0.195,0.25; VSS -2.395,0.25 | smd 0.75 x 1.1: DAT1 -4.545,0.25 | smd 1.55 x 1.35: GND1 5.565,0.375 | smd 1.17 x 1.8: GND2 -5.755,0.6 | smd 1.9 x 1.35: GND3 -3.73,11.075; GND4 2.24,11.075 | smd 1.2 x 1: SWA 5.74,6.4; SWB 5.74,10.1
SOT23-3 = smd 0.8 x 0.9: 1 -0.95,-1; 2 0.95,-1; 3 0,1.1
HEADER-3M-961-6P-2.54MM = smd 1.3 x 2.8: 1 -6.35,0; 2 -3.81,0; 3 -1.27,0; 4 1.27,0; 5 3.81,0; 6 6.35,0
CONREVSMA003.062 = smd 4.25 x 1.5 bottom: GND1 2.25,-2.54; GND3 2.25,2.54 | smd 4.25 x 1.5: GND2 2.25,-2.54; GND4 2.25,2.54; SIG 2.25,0
TOUCH-CIRCLE-15MM = smd 15 x 15: P$1 0,0
M22-63405 = smd 0.89 x 2.1: 1 -4,-2.6; 2 -4,2.65; 3 -2,-2.6; 4 -2,2.65; 5 0,-2.6; 6 0,2.65; 7 2,-2.6; 8 2,2.65; 9 4,-2.6; 10 4,2.65
M22-53205 = smd 1 x 1.65: 1 -4,-2.375; 2 -4,2.375; 3 -2,-2.375; 4 -2,2.375; 5 0,-2.375; 6 0,2.375; 7 2,-2.375; 8 2,2.375; 9 4,-2.375; 10 4,2.375
S-PVQFN-N40 = smd 0.85 x 0.28: 1 -3,2.25; 2 -3,1.75; 3 -3,1.25; 4 -3,0.75; 5 -3,0.25; 6 -3,-0.25; 7 -3,-0.75; 8 -3,-1.25; 9 -3,-1.75; 10 -3,-2.25; 21 3,-2.25; 22 3,-1.75; 23 3,-1.25; 24 3,-0.75; 25 3,-0.25; 26 3,0.25; 27 3,0.75; 28 3,1.25; 29 3,1.75; 30 3,2.25 | smd 0.28 x 0.85: 11 -2.25,-3; 12 -1.75,-3; 13 -1.25,-3; 14 -0.75,-3; 15 -0.25,-3; 16 0.25,-3; 17 0.75,-3; 18 1.25,-3; 19 1.75,-3; 20 2.25,-3; 31 2.25,3; 32 1.75,3; 33 1.25,3; 34 0.75,3; 35 0.25,3; 36 -0.25,3; 37 -0.75,3; 38 -1.25,3; 39 -1.75,3; 40 -2.25,3 | smd 4.5 x 4.5: GND 0,0
S-PVQFN-N16 = smd 1 x 0.35: 1 -1.9,0.975; 2 -1.9,0.325; 3 -1.9,-0.325; 4 -1.9,-0.975; 9 1.9,-0.975; 10 1.9,-0.325; 11 1.9,0.325; 12 1.9,0.975 | smd 0.35 x 1: 5 -0.975,-1.9; 6 -0.325,-1.9; 7 0.325,-1.9; 8 0.975,-1.9; 13 0.975,1.9; 14 0.325,1.9; 15 -0.325,1.9; 16 -0.975,1.9 | smd 2.16 x 2.16: GND 0,0
S-PVQFN-N32 = smd 0.85 x 0.28: 1 -2.475,1.75; 2 -2.475,1.25; 3 -2.475,0.75; 4 -2.475,0.25; 5 -2.475,-0.25; 6 -2.475,-0.75; 7 -2.475,-1.25; 8 -2.475,-1.75; 17 2.475,-1.75; 18 2.475,-1.25; 19 2.475,-0.75; 20 2.475,-0.25; 21 2.475,0.25; 22 2.475,0.75; 23 2.475,1.25; 24 2.475,1.75 | smd 0.28 x 0.85: 9 -1.75,-2.475; 10 -1.25,-2.475; 11 -0.75,-2.475; 12 -0.25,-2.475; 13 0.25,-2.475; 14 0.75,-2.475; 15 1.25,-2.475; 16 1.75,-2.475; 25 1.75,2.475; 26 1.25,2.475; 27 0.75,2.475; 28 0.25,2.475; 29 -0.25,2.475; 30 -0.75,2.475; 31 -1.25,2.475; 32 -1.75,2.475 | smd 3.45 x 3.45: GND 0,0
S-PQFP-N32 = smd 0.45 x 1: 1 -2.8,-4; 2 -2,-4; 3 -1.2,-4; 4 -0.4,-4; 5 0.4,-4; 6 1.2,-4; 7 2,-4; 8 2.8,-4; 17 2.8,4; 18 2,4; 19 1.2,4; 20 0.4,4; 21 -0.4,4; 22 -1.2,4; 23 -2,4; 24 -2.8,4 | smd 1 x 0.45: 9 4,-2.8; 10 4,-2; 11 4,-1.2; 12 4,-0.4; 13 4,0.4; 14 4,1.2; 15 4,2; 16 4,2.8; 25 -4,2.8; 26 -4,2; 27 -4,1.2; 28 -4,0.4; 29 -4,-0.4; 30 -4,-1.2; 31 -4,-2; 32 -4,-2.8
SOT-223 = smd 1.9 x 1.9: 1 -2.7,-3.1; 3 2.7,-3.1 | smd 1.1 x 1.9: 2 0,-3.1 | smd 6.7 x 1.9: 4 0,3.1
DFN-14 = smd 0.25 x 0.7: 1 -1.5,-1.45; 2 -1,-1.45; 3 -0.5,-1.45; 4 0,-1.45; 5 0.5,-1.45; 6 1,-1.45; 7 1.5,-1.45; 8 1.5,1.45; 9 1,1.45; 10 0.5,1.45; 11 0,1.45; 12 -0.5,1.45; 13 -1,1.45; 14 -1.5,1.45 | smd 3.3 x 1.7: GND 0,0
LQFP-144 = smd 0.3 x 1.6: 1 -8.75,10.6; 2 -8.25,10.6; 3 -7.75,10.6; 4 -7.25,10.6; 5 -6.75,10.6; 6 -6.25,10.6; 7 -5.75,10.6; 8 -5.25,10.6; 9 -4.75,10.6; 10 -4.25,10.6; 11 -3.75,10.6; 12 -3.25,10.6; 13 -2.75,10.6; 14 -2.25,10.6; 15 -1.75,10.6; 16 -1.25,10.6; 17 -0.75,10.6; 18 -0.25,10.6; 19 0.25,10.6; 20 0.75,10.6; 21 1.25,10.6; 22 1.75,10.6; 23 2.25,10.6; 24 2.75,10.6; 25 3.25,10.6; 26 3.75,10.6; 27 4.25,10.6; 28 4.75,10.6; 29 5.25,10.6; 30 5.75,10.6; 31 6.25,10.6; 32 6.75,10.6; 33 7.25,10.6; 34 7.75,10.6; 35 8.25,10.6; 36 8.75,10.6; 73 8.75,-10.6; 74 8.25,-10.6; 75 7.75,-10.6; 76 7.25,-10.6; 77 6.75,-10.6; 78 6.25,-10.6; 79 5.75,-10.6; 80 5.25,-10.6; 81 4.75,-10.6; 82 4.25,-10.6; 83 3.75,-10.6; 84 3.25,-10.6; 85 2.75,-10.6; 86 2.25,-10.6; 87 1.75,-10.6; 88 1.25,-10.6; 89 0.75,-10.6; 90 0.25,-10.6; 91 -0.25,-10.6; 92 -0.75,-10.6; 93 -1.25,-10.6; 94 -1.75,-10.6; 95 -2.25,-10.6; 96 -2.75,-10.6; 97 -3.25,-10.6; 98 -3.75,-10.6; 99 -4.25,-10.6; 100 -4.75,-10.6; 101 -5.25,-10.6; 102 -5.75,-10.6; 103 -6.25,-10.6; 104 -6.75,-10.6; 105 -7.25,-10.6; 106 -7.75,-10.6; 107 -8.25,-10.6; 108 -8.75,-10.6 | smd 1.6 x 0.3: 37 10.6,8.75; 38 10.6,8.25; 39 10.6,7.75; 40 10.6,7.25; 41 10.6,6.75; 42 10.6,6.25; 43 10.6,5.75; 44 10.6,5.25; 45 10.6,4.75; 46 10.6,4.25; 47 10.6,3.75; 48 10.6,3.25; 49 10.6,2.75; 50 10.6,2.25; 51 10.6,1.75; 52 10.6,1.25; 53 10.6,0.75; 54 10.6,0.25; 55 10.6,-0.25; 56 10.6,-0.75; 57 10.6,-1.25; 58 10.6,-1.75; 59 10.6,-2.25; 60 10.6,-2.75; 61 10.6,-3.25; 62 10.6,-3.75; 63 10.6,-4.25; 64 10.6,-4.75; 65 10.6,-5.25; 66 10.6,-5.75; 67 10.6,-6.25; 68 10.6,-6.75; 69 10.6,-7.25; 70 10.6,-7.75; 71 10.6,-8.25; 72 10.6,-8.75; 109 -10.6,-8.75; 110 -10.6,-8.25; 111 -10.6,-7.75; 112 -10.6,-7.25; 113 -10.6,-6.75; 114 -10.6,-6.25; 115 -10.6,-5.75; 116 -10.6,-5.25; 117 -10.6,-4.75; 118 -10.6,-4.25; 119 -10.6,-3.75; 120 -10.6,-3.25; 121 -10.6,-2.75; 122 -10.6,-2.25; 123 -10.6,-1.75; 124 -10.6,-1.25; 125 -10.6,-0.75; 126 -10.6,-0.25; 127 -10.6,0.25; 128 -10.6,0.75; 129 -10.6,1.25; 130 -10.6,1.75; 131 -10.6,2.25; 132 -10.6,2.75; 133 -10.6,3.25; 134 -10.6,3.75; 135 -10.6,4.25; 136 -10.6,4.75; 137 -10.6,5.25; 138 -10.6,5.75; 139 -10.6,6.25; 140 -10.6,6.75; 141 -10.6,7.25; 142 -10.6,7.75; 143 -10.6,8.25; 144 -10.6,8.75
STANDOFF_3/16 = hole 2.946: 0,0
SO08 = smd 0.61 x 2.21: 1 -1.905,-2.616; 2 -0.635,-2.616; 3 0.635,-2.616; 4 1.905,-2.616; 5 1.905,2.616; 6 0.635,2.616; 7 -0.635,2.616; 8 -1.905,2.616
USB_MICRO_AB = smd 0.4 x 1.4: 1 -1.3,2.85; 2 -0.65,2.85; 3 0,2.85; 4 0.65,2.85; 5 1.3,2.85 | smd 2.3 x 1.9: GND1 -3.75,0; GND4 3.75,0 | smd 1.8 x 1.9: GND2 -1.15,0; GND3 1.15,0
ABM3C = smd 1.6 x 1.3: 1 -1.9,-1.15; 2 1.9,-1.15; 3 1.9,1.15; 4 -1.9,1.15
ABM3B = smd 1.8 x 1.2: 1 -2,-1.2; 2 2,-1.2; 3 2,1.2; 4 -2,1.2
ABM8G = smd 1.4 x 1.2: GND-1 -1.1,0.85; GND-2 1.1,-0.85; X1 1.1,0.85; X2 -1.1,-0.85

### Placement (x,y rotation side)
AVR  2.75,66.75 180 top
B1  3.75,89.75 270 top
C1  -24.25,145.75 0 top  (outside the outline)
C2  -25.5,137.75 0 top  (outside the outline)
C3  -28.25,147.75 0 top  (outside the outline)
C4  -27.5,143.75 0 top  (outside the outline)
C5  -40,140.5 180 top  (outside the outline)
C6  -38.75,146 90 top  (outside the outline)
C7  -36.75,147.5 90 top  (outside the outline)
C8  -28.75,139.75 0 top  (outside the outline)
C9  -31.25,137 270 top  (outside the outline)
C10  -33.25,137 270 top  (outside the outline)
C11  -35.75,136.25 270 top  (outside the outline)
C12  -40.5,138.5 180 top  (outside the outline)
C13  -28.25,151.75 0 top  (outside the outline)
C14  -28.25,149.75 0 top  (outside the outline)
C15  -22.75,134 90 top  (outside the outline)
C16  -24.25,129 270 top  (outside the outline)
C17  -22.25,129 270 top  (outside the outline)
C18  -30.65,134 90 top  (outside the outline)
C19  -28.75,134 90 top  (outside the outline)
C20  -35.75,123.75 180 top  (outside the outline)
C21  -35.75,125.65 180 top  (outside the outline)
C22  -29.25,131.5 0 top  (outside the outline)
C23  -28.25,145.75 0 top  (outside the outline)
C24  -42,133 180 top  (outside the outline)
C25  -33.25,118.25 270 top  (outside the outline)
C26  -33.25,111.25 270 top  (outside the outline)
C27  -32.25,123.75 0 top  (outside the outline)
C28  -32.25,115.75 0 top  (outside the outline)
C29  -43.5,135.5 90 top  (outside the outline)
C30  45.5,81.75 270 top
C31  -62.5,135.25 270 top  (outside the outline)
C32  -53.5,135.25 270 top  (outside the outline)
C33  -112.75,-143.75 0 top  (outside the outline)
C34  -24.5,17 270 top  (outside the outline)
C35  -54.75,65 180 bottom  (outside the outline)
C36  -19,17 270 top  (outside the outline)
C37  -60,150 270 top  (outside the outline)
C38  -58,150 270 top  (outside the outline)
C39  -22.5,17 270 top  (outside the outline)
C40  -59.5,138.5 270 top  (outside the outline)
C41  -61.5,138.5 270 top  (outside the outline)
C42  -60.5,135.25 270 top  (outside the outline)
C43  31.5,74 0 top
C44  31.5,76 0 top
C45  -53.75,146.75 90 top  (outside the outline)
C46  37.5,79.5 270 top
C47  29,79.75 90 top
C48  -62.25,141 180 top  (outside the outline)
C49  -57.5,138.5 270 top  (outside the outline)
C50  -62.75,144.75 180 top  (outside the outline)
C51  -65,71.5 180 bottom  (outside the outline)
C52  -70,69.25 0 bottom  (outside the outline)
C53  -72.5,68.75 270 bottom  (outside the outline)
C54  -61.75,60.75 90 bottom  (outside the outline)
C55  89.5,85.25 0 bottom
C56  -112.5,-160 0 top  (outside the outline)
C57  -112.5,-165 0 top  (outside the outline)
C58  86.25,95 90 bottom
C59  90,98 180 bottom
C60  93.25,98 180 bottom
C61  98.75,92 180 bottom
C62  99,88.75 90 bottom
C63  114.5,84.25 0 bottom
C64  99,94.5 180 bottom
C65  47,93 0 top
C66  97.75,86.25 0 bottom
C67  94.5,85.25 0 bottom
CC8531  2.75,64.25 180 top
CCD  23.5,87.25 180 top
CHARGE  2.75,61.75 180 top
D1  -57.75,61.25 270 top  (outside the outline)
EXT  -39.25,49.75 270 top  (outside the outline)
F1  -65,69.75 90 top  (outside the outline)
ICSP  32,87.25 270 top
L1  -24.25,143.75 0 top  (outside the outline)
L2  -25.5,139.75 0 top  (outside the outline)
L3  -24.75,134 90 top  (outside the outline)
L4  -37.75,150.75 90 top  (outside the outline)
L5  -46,145.5 0 top  (outside the outline)
L6  -42.5,144.5 0 top  (outside the outline)
L7  -33.25,126.25 270 top  (outside the outline)
L8  -33.25,121.25 270 top  (outside the outline)
L9  -46,143.5 0 top  (outside the outline)
L10  -32.25,113.75 180 top  (outside the outline)
L11  -42.5,142.5 0 top  (outside the outline)
L12  -28.75,141.75 0 top  (outside the outline)
L13  -46,141.5 0 top  (outside the outline)
L14  -64.5,135.25 270 top  (outside the outline)
L15  -55.5,135.25 270 top  (outside the outline)
L16  -57.25,64.5 270 bottom  (outside the outline)
L17  -66.25,69 0 bottom  (outside the outline)
L18  44.25,92.25 270 top
LED1  74.5,88.75 180 bottom
LED2  115.5,89 0 bottom
LED3  74.5,10 180 bottom
LED4  115.5,10 0 bottom
LINE_IN  13,0 0 top
MICROSD  0.5,76.25 270 top
PHONE_OUT  37,0 0 top
POWER  2.75,59.25 180 top
Q1  -70,66.25 0 bottom  (outside the outline)
Q2  117.25,92.5 180 bottom
Q3  110.5,90.75 90 bottom
Q4  110.5,87 90 bottom
R1  -28.25,154.25 90 top  (outside the outline)
R2  -30.25,154.25 90 top  (outside the outline)
R3  -73.75,56.5 90 bottom  (outside the outline)
R4  -28.75,137.75 180 top  (outside the outline)
R5  -35.75,150.75 90 top  (outside the outline)
R6  -49,64.5 180 bottom  (outside the outline)
R7  -43.75,139.5 180 top  (outside the outline)
R8  -26.75,132 270 top  (outside the outline)
R9  -38.5,132 90 top  (outside the outline)
R10  -25.5,141.75 180 top  (outside the outline)
R11  17.5,68.5 90 top
R12  -16.5,18.25 90 top  (outside the outline)
R13  -16.5,21.5 90 top  (outside the outline)
R14  -59.75,56.5 90 top  (outside the outline)
R15  -26.5,21.5 90 top  (outside the outline)
R16  -29,22.5 180 top  (outside the outline)
R17  -65.5,145 90 top  (outside the outline)
R18  -71,60.5 0 bottom  (outside the outline)
R19  -64.25,59.75 0 bottom  (outside the outline)
R20  -64.25,61.75 0 bottom  (outside the outline)
R21  -68.75,62.25 180 bottom  (outside the outline)
R22  -112.75,-126 0 top  (outside the outline)
R23  -112.75,-130.75 0 top  (outside the outline)
R24  -112.75,-135.5 0 top  (outside the outline)
R25  -112.75,-140.25 0 top  (outside the outline)
R26  86.25,85.25 0 bottom
R27  -21.5,-107.5 0 top  (outside the outline)
R28  -21.5,-112.5 0 top  (outside the outline)
R29  -21.5,-117.5 0 top  (outside the outline)
R30  -21.5,-122.5 0 top  (outside the outline)
R31  -112.75,-148.5 0 top  (outside the outline)
R33  84.25,95 270 bottom
R34  86.75,98 0 bottom
R35  96.5,98 180 bottom
R36  92,85 270 bottom
R37  102,91.5 180 bottom
R38  101,88.75 270 bottom
R39  101,85.25 180 bottom
R40  97.75,84.25 180 bottom
SERIAL  24.75,93 0 top
SMA  50,87.25 180 top
SW1  82.5,80 0 top
SW4  82.5,60 0 top
SW5  82.5,40 0 top
SW6  107.5,20 0 top
SW7  107.5,40 0 top
SW8  107.5,60 0 top
SW9  107.5,80 0 top
SW10  82.5,20 0 top
TO_AUX  38,96 180 top
TO_MAIN  108,96 0 bottom
U1  -34,142.25 270 top  (outside the outline)
U2  -34.2,131 270 top  (outside the outline)
U3  -57.75,143.75 180 top  (outside the outline)
U4  24.5,74.75 90 top
U5  -71.5,74.5 270 bottom  (outside the outline)
U6  -66.25,65 0 bottom  (outside the outline)
U7  12.5,45.25 180 top
U8  92.25,91.25 90 bottom
U$1  [STANDOFF_3/16]  47,97 90 top
U$2  [PHONE_PLUG]  37,-3 270 top
U$3  [PHONE_PLUG]  13,-3 270 top
U$4  [UBBP01]  0,12 0 top
U$5  [STANDOFF_3/16]  73,97 270 top
U$6  [STANDOFF_3/16]  3,3 270 top
U$7  [STANDOFF_3/16]  3,97 90 top
U$8  [STANDOFF_3/16]  47,3 90 top
U$9  [TRANS_SILK]  61.25,21.5 0 top
U$10  [OSHW_FILLX150_NOTEXT]  55,40 0 top
U$11  [STANDOFF_3/16]  117,97 90 top
U$12  [STANDOFF_3/16]  73,3 270 top
U$13  [STANDOFF_3/16]  117,3 270 top
U$14  [UBBP01]  70,12 0 top
U$15  -20,29.75 90 top  (outside the outline)
USB  11.25,98.5 180 top
V_CHRG  -66,76.25 270 bottom  (outside the outline)
X1  -39.5,135.75 0 top  (outside the outline)
X2  33.25,79.25 180 top
X3  -112,-156 0 top  (outside the outline)

### Tracks (layer width: path | path; a pad name or v marks a point on that pad's centre or on a via)
3.3V  (via drill 0.4)  (11 unrouted)
  other vias: -23.25,143.75 -24.5,139.75 -24.75,135 -64.5,134.25 -55.5,134.25
!SD_CARD  (3 unrouted)
AGND  (via drill 0.4)  (8 unrouted)
  Top 0.2: U3.17 -60.23,145.97 v-60.5,146.25
  Top 0.254: U3.17 -60.23,145.47
  other vias: -65.5,146 -24.5,16
AUX_!CHANGE  (via drill 0.4)
  Top 0.2: v92.75,93 92.75,97.75 94.5,99.5 103,99.5 v104,98.5
  Bottom 0.2: U8.28 92.65,92.9 v92.75,93 | 103.88,98.5 v104,98.5 TO_MAIN.10
AUX_BLUE
  Bottom 0.3: Q4.1 107.2,86.05 106,87.25 TO_MAIN.7
AUX_CS
  Bottom 0.2: U8.14 93.5,94.8 93.5,96.5 94,97 105.5,97 106,97.5 TO_MAIN.8
AUX_GREEN
  Bottom 0.3: Q3.1 108.45,89.8 108,90.25 TO_MAIN.5
AUX_MISO
  Bottom 0.2: U8.16 95.05,95.55 95.5,96 109.5,96 110,96.5 TO_MAIN.4
AUX_MOSI
  Bottom 0.2: U8.15 94.25,96.25 94.5,96.5 107.75,96.5 108,96.75 TO_MAIN.6
AUX_RED
  Bottom 0.3: Q2.1 116,93.5 114.5,95 110.5,95 110,94.5 TO_MAIN.3
AUX_SCLK
  Bottom 0.2: U8.17 96.25,94.75 97,95.5 111.5,95.5 112,96 TO_MAIN.2
AUX_VDD  (via drill 0.4)
  Top 0.2: R36.2 92,91
  Top 0.5: v71.75,15.75 v71.75,12 71.75,10.25 76.5,5.5 v113.25,5.5 | v95,92.75 93.25,91 92,91 v89.75,91 | v112,93.75 98.75,93.75 C64.1
  Bottom 0.2: U8.18 96.75,93.25 C64.1
  Bottom 0.5: LED4.2 117,9.15 LED4.2-2 | LED3.2 73,10.85 LED3.2-2 71.75,12.1 v71.75,12 | 72,90.5 LED1.2-2 73,89.6 LED1.2 73.75,89.5 74.5,88.75 74.5,84.75 71.75,82 v71.75,15.75 | LED4.2 117,7 116.25,7 114.75,5.5 v113.25,5.5 | LED4.2 116,9.25 115.5,9.75 115.5,14.5 118,17 118,84.25 | U8.18 95.5,93.25 v95,92.75 | U8.4 89.6,90.85 v89.75,91 | v112,93.75 TO_MAIN.1 114.62,93.62 115.5,92.75 115.5,89 116.25,88.25 LED2.2 118,87.25 LED2.2-2 118,84.25 | C63.1 118,84.25
  other vias: 92,84 98,94.5
AUX_VSS
  pour Bottom: 70,100 120,100 120,0 70,0
AVDD  (via drill 0.4)  (5 unrouted)
  Top 0.254: U1.31 -29.85,140 C8.1 | U1.20 -37,139.75 -38.25,138.5 C12.1 -39.6,138.5 | U1.23 -35.25,137.6 C11.1 | U1.27 -33.25,138.1 | -33.25,138.1 C10.1 | U1.28 -32.75,138.35 C10.1 | U1.26 -33.75,138.35 C10.1 | C10.1 -33.25,137.75 | C9.1 -33.15,138 -33.25,138.1
  other vias: -26.5,137.75 -26.5,139.75 -29.75,139.75 -39.5,138.5 -35.75,137.25 -31.25,138 -33.25,138
AVDD_AMP  (via drill 0.4)  (11 unrouted)
  Top 0.254: U2.1 -30.9,132.9 | U2.13 -24.43,130.03 C16.1 -24.35,129.85 -24.5,130 | U2.10 -34.5,129.1 -34.5,125.65 | U2.16 -30.57,131.97 C22.1 -30.15,131.5
  other vias: -38.5,133 -24.75,133 -22.75,133 -30.65,133 -24.25,130 -34.75,125.65 -30.25,131.5
AVDD_CODEC  (via drill 0.4)  (7 unrouted)
  Top 0.3: U3.26 -59,140 C40.1 -60.5,139.5 | C41.1 -60.5,139.5 | C42.1 -60.5,139.5
  other vias: -64.5,136.25 -62.5,136.25 -60.5,136.25 -61.5,139.5 -59.5,139.5
AVR_PWR  (9 unrouted)
BAT  (2 unrouted)
BCLK  (via drill 0.4)
  Top 0.2: v-51.25,142.25 -51.5,142.5 U3.2
  Bottom 0.2: L6.1 -49,144.5 v-51.25,142.25
  other vias: -43.5,144.5
CS_CC8531  (2 unrouted)
CS_CODEC  (1 unrouted)
CS_SD  (2 unrouted)
D+  (via drill 0.4)  (2 unrouted)
  other vias: -44.75,139.5
D-  (1 unrouted)
DIN
  Top 0.2: U3.4 -49.25,143.5 -47.25,141.5 L13.1
DOUT
  Top 0.2: U3.5 -49,144 -47.5,142.5 L11.1
DVDD
  Top 0.3: U3.29 C49.1
DVDD_CODEC  (via drill 0.4)  (4 unrouted)
  Top 0.2: U3.12 -57.5,147.5 v-57,148
  Top 0.254: U3.6 -54.5,144.5 -54.25,144.75 -54.25,145.25 C45.1
  Top 0.3: U3.30 -57,140.5 v-56.25,139.75
  other vias: -55.5,136.25 -53.5,136.25 -53.75,145.75
GND  (via drill 0.4)  (138 unrouted)
  Top 0.2: C21.2 v-36.75,125.6 | v-32.5,129 -33.25,129
  Top 0.254: U1.8 -35.25,143.5 U1.GND -33.75,142 | U1.29 -32.25,140.5 v-33.5,141.75 | U1.34 -33.25,141.5 v-33.5,141.75 | v-33.5,141.75 -33.75,142 | U1.35 -33.75,142 | U3.28 -58,143.5 U3.GND -56.5,145 U3.7 | U2.8 -35.17,130.03 | U2.9 -35.17,130.03 | -35.17,130.03 U2.GND | U2.12 -33.23,130.03 U2.GND | U2.14 -33.88,130.68 U2.GND | X1.2 -37.6,134.65 v-37.5,134.5 | X1.4 v-41.25,136.75
  other vias: -35.75,135.25 -33.25,136 -31.25,136 -28.75,135 -30.65,135 -22.75,135 -24.5,137.75 -24.5,141.75 -23.25,145.75 -26.75,133 -36.75,123.75 -27.25,147.75 -27.25,145.75 -36.75,148.5 -38.75,147 -41,140.5 -41.5,138.5 -35.5,143.75 -34.5,143.75 -33.5,143.75 -32.5,143.75 -32.5,142.75 -33.5,142.75 -34.5,142.75 -35.5,142.75 -35.5,141.75 -34.5,141.75 -32.5,141.75 -32.5,140.75 -33.5,140.75 -34.5,140.75 -35.5,140.75 -36,129.1 -34.7,131.5 -33.7,131.5 -33.7,130.5 -34.7,130.5 -31.25,123.75 -31.25,115.75 -31.25,113.75 -28.25,131.5 -24.25,128 -22.25,128 -27.75,137.75 -27.75,139.75 -26.5,143.75 -27.25,151.75 -27.25,149.75 -57.75,143.75 -58.75,142.75 -57.75,142.75 -56.75,142.75 -56.75,143.75 -58.75,143.75 -58.75,144.75 -57.75,144.75 -56.75,144.75 -59.5,137.5 -60.5,134.25 -62.5,134.25 -61.5,137.5 -57.5,137.5 -63.25,141 -63.75,144.75 -53.5,134.25 -53.75,147.75 -65.5,144 -35.25,121.75 -35.25,119.75 -35.25,117.75 -35.25,115.75 -35.25,113.75 -35.25,111.75 -31.25,111.75 -31.25,117.75 -31.25,119.75 -31.25,121.75 -31.25,127.75 -31.25,126
IN_L  (1 unrouted)
IOVDD  (via drill 0.4)  (6 unrouted)
  Top 0.254: U1.10 -36.75,145.75 C7.1 -36.75,147 | U1.40 -31,146.75 -30,147.75 C3.1 -29,148 | U1.37 -29.1,143 C4.1 v-28.4,143.75 | U1.18 -38.5,141 -38.85,140.65 | -38.85,140.65 C5.1 -39.1,140.5 -38.85,140.65 | U1.12 -37.75,144 C6.1
  other vias: -25.25,143.75 -25.25,145.75 -36.75,146.5 -29.25,147.75 -39,140.5 -38.75,145
IOVDD1
  Top 0.254: U1.1 -31.75,148.75 -30.75,149.75 C14.1 -29,149.75 -28.25,150.5 R1.1
IOVDD2
  Top 0.254: U1.2 -32.25,149.25 -29.75,151.75 C13.1 -30.25,152.75 R2.1
LINE_L  (1 unrouted)
LINE_R  (1 unrouted)
LINEIN_SENSE  (1 unrouted)
LNA_EN  (via drill 0.4)  (1 unrouted)
  Top 0.2: U2.6 -36.83,131.32 v-37.5,132 | v-29.75,143.75 -30,143.75 -30.25,143.5
  Bottom 0.2: v-37.5,132 -37.5,133 -36,134.5 -32.75,134.5 -32.25,135 -32.25,138.75 -31,140 -31,142.5 v-29.75,143.75
MCLK  (via drill 0.4)
  Top 0.2: v-52.75,141.75 -53,142 U3.1
  Bottom 0.2: L5.1 -49,145.5 v-52.75,141.75
  other vias: -47,145.5
MISO  (6 unrouted)
MISO_SD  (2 unrouted)
MOSI  (6 unrouted)
MOSI_SD  (2 unrouted)
N$1
  Top 0.254: U1.21 -36.75,139.25 -38,138 -38.5,138 -39,137.5 -40,137.5 -40.25,137.25 -40.25,134.75 -40.4,134.6 X1.1 -41.5,134.5 -41.65,134.65 -41.6,134.65 | C29.1 -41.75,134.5 -41.6,134.65 | -41.6,134.65 -41.5,134.75
N$2  (1 unrouted)
  Top 0.254: U1.22 -35.75,138.5 -36,138.25 -37,138.25 -37.6,137.65 | X1.3 -39.35,136.9 -39.75,136.5 -39.75,133.75 -40.5,133 C24.1
N$3
  Top 0.254: U1.11 -37,144.75 -37.75,145.5 L4.1
N$4
  Top 0.2: U1.16 -41,142 L11.2
N$5
  Top 0.2: U1.14 -39.75,143 -41,144.25 -41.25,144.25 L6.2
N$6  (1 unrouted)
N$7
  Top 0.254: U2.15 -31.57,131.32 -30.75,130.5 -27.25,130.5 R8.2
N$8
  Top 0.254: U2.7 -38.03,130.68 R9.1
N$9  (1 unrouted)
N$10
  Bottom 0.2: R26.1 C55.2 88.5,86 88.75,86.25 90,86.25 90.25,86.5 U8.31
N$11
  Bottom 0.2: C55.1 90.75,85.25 91.05,85.55 U8.30
N$12  (2 unrouted)
N$13
  Top 0.46: U2.11 -33.88,127.72 L7.1
N$14
  Top 0.46: L7.2 C27.1 L8.1
N$15
  Top 0.46: L8.2 C25.1
N$16
  Top 0.46: C25.2 C28.1 -33.25,113.5 | -33.25,113.5 C26.1 | -33.25,113.5 -33.1,113.65 L10.2
N$17
  Top 0.254: U3.24 -60.23,141.53 -60.75,141 C48.1
N$18
  Top 0.254: U1.36 -30.35,142.5 -29.75,141.9 L12.1
N$19
  Top 0.254: U1.30 -30.75,139.25 -29.6,138.1 R4.2
N$20  (2 unrouted)
N$21
  Top 0.254: U1.39 -30.5,144 -29.75,144.75 -29.5,144.75 -29.1,145.15 C23.1
N$22  (1 unrouted)
N$23
  Top 0.2: U1.13 -39.25,143.5 -40.25,144.5 -40.25,145 -40.75,145.5 L5.2
N$24
  Top 0.254: R7.1 -38.25,139.5 -38,139.75 -38,140.25 -37.75,140.5 U1.19
N$25
  Top 0.2: L9.2 -41,143.5 -40,142.5 U1.15
N$26  (1 unrouted)
N$27
  Top 0.2: L13.2 U1.17
N$28
  Top 0.254: U1.9 R5.1
N$29  (1 unrouted)
N$30
  Bottom 0.2: U8.9 87,95.25 C58.2 R33.1
N$31  (1 unrouted)
N$32  (1 unrouted)
N$33  (1 unrouted)
N$34  (1 unrouted)
N$35  (1 unrouted)
N$36  (1 unrouted)
N$37  (2 unrouted)
N$38  (2 unrouted)
N$39  (1 unrouted)
  Top 0.4: -19,19.48 C36.1 -17.25,18 R12.1
N$40  (2 unrouted)
  Top 0.4: -22.86,20.86 -22.5,20.5 C39.1 | -26.14,20.86 R15.1
N$41
  Bottom 0.2: U8.11 91.05,97.95 C59.2 90.75,98.25 90.75,98.5 90.25,99 88.25,99 87.75,98.5 R34.1
N$42
  Bottom 0.2: U8.13 92.65,96.4 C60.2 R35.1
N$43  (2 unrouted)
N$44  (via drill 0.4)
  Top 0.2: v86.25,87.25 86.25,83.75 SW1.P$1
  Bottom 0.2: R26.2 85.25,86.25 v86.25,87.25
N$45  (2 unrouted)
N$46  (1 unrouted)
N$47  (1 unrouted)
N$48  (1 unrouted)
N$49  (5 unrouted)
N$50  (1 unrouted)
N$51  (1 unrouted)
N$52  (4 unrouted)
N$53  (1 unrouted)
  Top 0.4: -16.86,20.86 R13.1 R12.2
N$54  (1 unrouted)
  Top 0.4: -26.14,22.14 R15.2 R16.1
N$55  (1 unrouted)
N$56  (4 unrouted)
N$57  (6 unrouted)
N$58  (1 unrouted)
N$59  (2 unrouted)
N$60
  Bottom 0.2: U8.8 86.3,94.05 C58.1
N$61  (via drill 0.4)
  Top 0.2: SW4.P$1 77,60 72.25,64.75 72.25,84.25 82,94 R33.2
  other vias: 84.25,94
N$62
  Bottom 0.2: U8.10 90.25,96 89,97.25 C59.1
N$63  (via drill 0.4)
  Top 0.2: SW5.P$1 75.5,40 70.75,44.75 70.75,87 81.75,98 R34.2
  other vias: 85.75,98
N$64
  Bottom 0.2: U8.12 91.85,97.6 C60.1
N$65  (via drill 0.4)
  Top 0.2: SW6.P$1 113.5,20 118.25,24.75 118.25,90.5 111.75,97 103.25,97 102.25,98 R35.2
  other vias: 97.5,98
N$66
  Bottom 0.2: U8.25 95.75,87.25 C66.2 96.75,85.5 97,85.25 R39.1
N$67  (2 unrouted)
N$68
  Bottom 0.2: U8.27 93.45,85.3 C67.2 93.5,84.5 93.75,84.25 R40.1
N$69
  Bottom 0.2: U8.24 96.55,88.45 C66.1
N$70  (via drill 0.4)
  Top 0.2: v102.75,86.75 102.75,84.75 SW9.P$1
  Bottom 0.2: R39.2 102,86 v102.75,86.75
N$71
  Bottom 0.2: U8.19 96.7,92.45 97.25,93 99.25,93 99.5,92.75 99.5,92.25 C61.2 100.25,91.5 R37.1
N$72  (via drill 0.4)
  Top 0.2: SW7.P$1 113.75,40 117.5,43.75 117.5,89 115,91.5 R37.2
  other vias: 103,91.5
N$73
  Bottom 0.2: U8.22 98.7,90.05 C62.2 R38.1
N$74  (via drill 0.4)
  Top 0.2: SW8.P$1 109.25,60 115.5,66.25 115.5,85 111.75,88.75 104,88.75 103,87.75 R38.2
  other vias: 101,87.75
N$75
  Bottom 0.2: U8.23 97.5,89.25 C62.1
N$76
  Bottom 0.2: U8.20 97.4,91.65 C61.1
N$77
  Bottom 0.2: U8.29 91.85,86.15 R36.1
N$78  (via drill 0.4)
  Top 0.5: v118,11.5 118,7.5 117.25,6.75 v80.5,6.75 | v119.25,90 v119.25,84.25
  Bottom 0.5: LED1.1 72,87 LED1.1-2 70.75,85.65 70.75,15 71.25,14.5 74,14.5 74.5,14 74.5,10 73.75,9.25 LED3.1 73.25,8.9 72.42,8.32 | 72.42,8.32 LED3.1-2 | v80.5,6.75 79,5.25 75.5,5.25 72.42,8.32 | LED4.1 117.25,10.75 v118,11.5 LED4.1-2 119.25,13.1 v119.25,84.25 | Q2.3 117.45,91.4 LED2.1-2 117,89.85 LED2.1 118.5,89.75 118.75,90 v119.25,90
N$79  (via drill 0.4)
  Top 0.5: v76,14.75 v76,8 | v81,9.25 v109.5,9.25 | v112.75,90.5 116.25,87 v116.25,82.75
  Bottom 0.5: v76,14.75 75,15.75 73.5,15.75 72.75,16.5 72.75,81 77,85.25 LED1.4-2 76,87.9 LED1.4 | v76,8 76.85,8 LED3.4-2 | LED3.4 76,9.15 LED3.4-2 | LED3.4-2 79.9,8.15 v81,9.25 | LED4.4-2 111.9,10.75 111,10.75 v109.5,9.25 | LED4.4 114,10.85 LED4.4-2 | LED2.4 114,89.85 LED2.4-2 112.9,90.75 Q3.3 112.5,90.75 v112.75,90.5 | v116.25,82.75 116.25,17 113,13.75 LED4.4-2
N$80  (via drill 0.4)
  Top 0.5: v81,10.75 107.05,10.75 v107.15,10.85
  Bottom 0.5: LED3.3-2 77,16 73.75,19.25 73.75,78.5 79.5,84.25 79.5,89.75 78.65,90.6 LED1.3-2 76,89.6 LED1.3 | LED3.3 76,10.85 LED3.3-2 | LED4.3 114,8.75 113.4,8.15 LED4.3-2 111.1,7.9 107.85,7.9 107.25,8.5 107.25,11.75 | Q4.3 112.75,87 112.9,87.15 | 112.9,87.15 LED2.3 | 112.4,87.15 112.9,87.15 | 112.9,87.15 LED2.3-2 114.5,85.65 114.5,19 107.35,11.85 | 107.35,11.85 107.25,11.75 | LED3.3-2 79.9,11.85 v81,10.75 | 107.35,11.85 v107.15,10.85 107.25,11.75
N$81
  Bottom 0.2: U8.26 94.25,86.5 C67.1
N$82  (via drill 0.4)
  Top 0.2: SW10.P$1 95.25,20 98.75,23.5 R40.2
  other vias: 98.75,84.25
N$83  (2 unrouted)
OUT_L  (2 unrouted)
OUT_R  (1 unrouted)
PA_EN  (via drill 0.4)  (1 unrouted)
  Top 0.2: v-36.25,132.75 -36.25,132.12
  Top 0.254: -26.65,141.75 R10.2 L12.2
  Bottom 0.2: L12.2 -28.5,141.75 -28.75,141.5 -28.75,136.75 -29.75,135.75 -29.75,134.25 -30,134 -35.75,134 -36.25,133.5 v-36.25,132.75
  other vias: -27.75,141.75
PHONE_L  (1 unrouted)
PHONE_R  (1 unrouted)
PHONE_SENSE  (1 unrouted)
PROG_PWR  (2 unrouted)
REF
  Top 0.254: U3.18 -61.5,145 C50.1
RESET_AVR  (3 unrouted)
RESET_CC8531  (2 unrouted)
  Top 0.2: L4.2 -36.75,152.75 -35.25,152.75 -35,153
RESET_CODEC  (1 unrouted)
RF_N  (1 unrouted)
RF_P  (1 unrouted)
  Top 0.254: U2.4 -35.17,134.07 -34.75,134.5
RTS/DTS  (1 unrouted)
RX  (1 unrouted)
SCLK  (6 unrouted)
  Top 0.2: -54.75,146.03 U3.8
SCLK_SD  (2 unrouted)
TX  (1 unrouted)
VBUS  (1 unrouted)
WCLK  (via drill 0.4)
  Top 0.2: U3.3 -50,143 v-49.75,142.75
  Bottom 0.2: L9.1 -49,143.5 v-49.75,142.75
  other vias: -47,143.5

### Text on the board
tPlace: open | hardware | PCB designed for | 4-layer 1.6mm | stackup: FR-4 | with 2 x 2116 | prepreg and | 1oz copper | Use RP-SMA (M) | antenna | Eva Kloiber | Feb 2013
tDocu: AVDD_PA1 | 1.85mm | AVDD_LNA | AVDD_PA2 | 6.90mm | 2.40mm